# Altium project SPARTAN6.PrjPcb
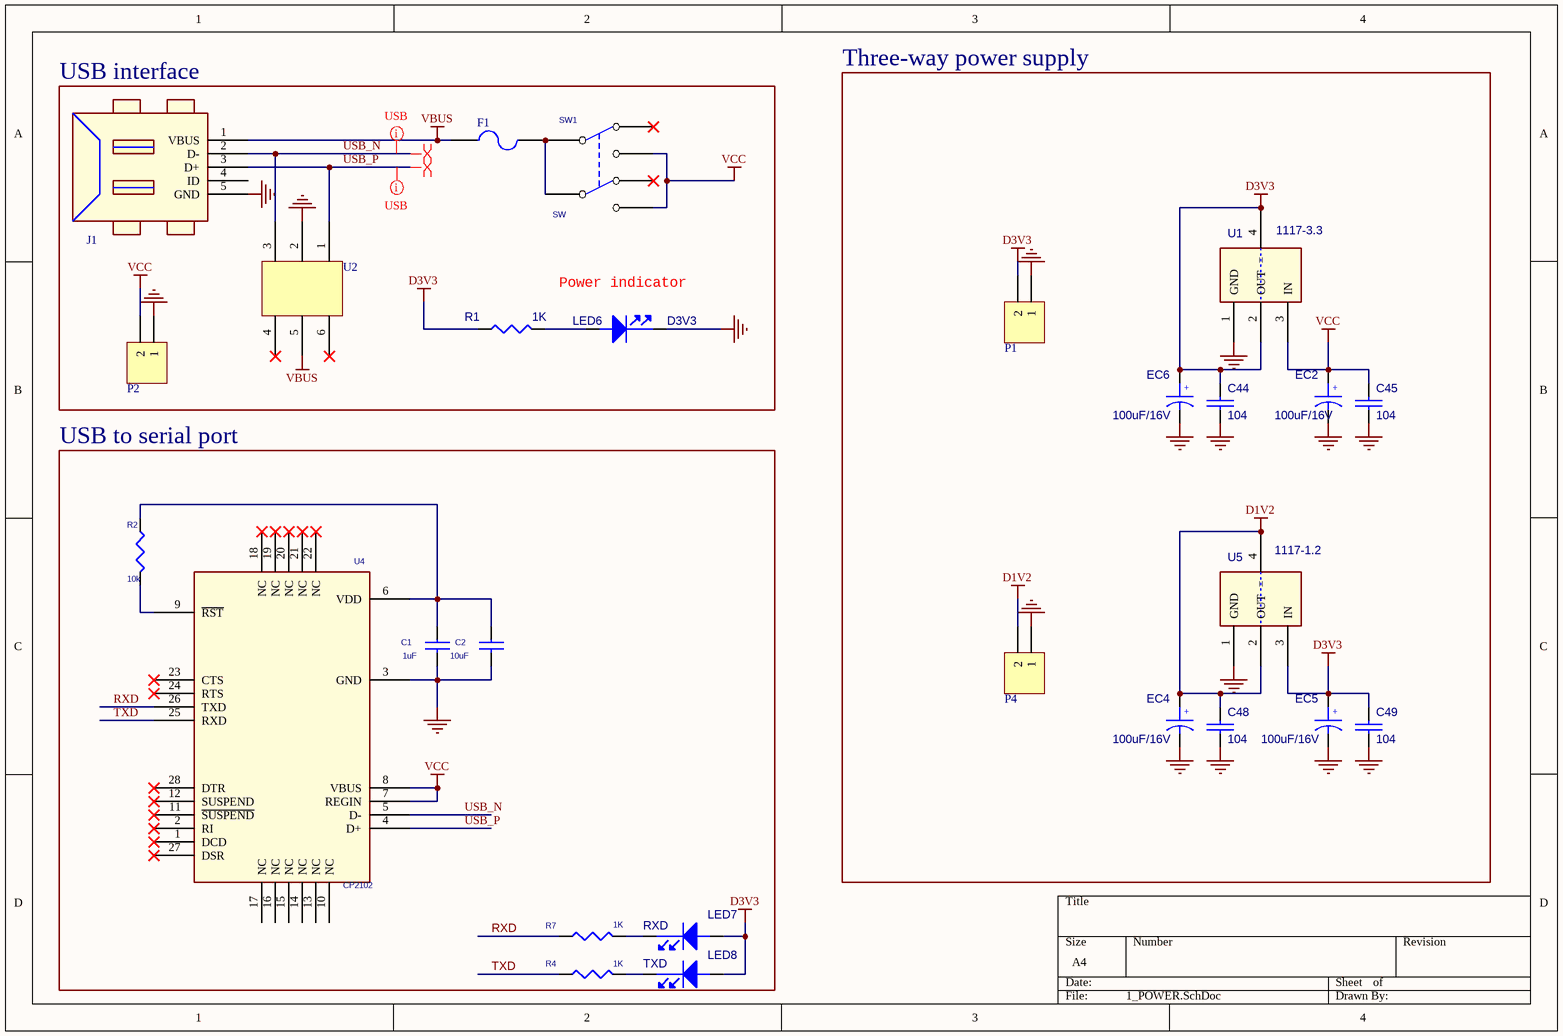
[diagram p0: 1_POWER.SchDoc]
7 sheets, 184 parts. Net scope: global (net labels, ports and power ports of the same name join across sheets).
Board file: PCB3.PcbDoc
Sheets:
  1_POWER.SchDoc
  2_FPGA.SchDoc
  3_FPGA.SchDoc
  4_FPGA.SchDoc
  5_SDRAM.SchDoc
  6_DIG.SchDoc
  7_VGA.SchDoc

## Sheet 1_POWER.SchDoc: AX309   Http://www.heijin.org
size A4; DocumentNumber: 1; Revision: 1.0; SheetNumber: 1; SheetTotal: 7; PageSetup: Record=PageOptions|CenterHorizontal=True|CenterVertical=True|PrintScale=1.00|XCorrection=1.00|YCorrection=1.00|PrintKind=0|BorderSize=5000000|LeftOffset=0|BottomOffset=0|Orientation=2|PaperLength=1000|PaperWidth=1000|Scale=100|PaperSource=7|PrintQuality=-4|MediaType=1|DitherType=10|PrintScaleMode=1|PaperKind=A4|PaperIndex=9

### Parts
C1  1uF  [0603]
C2  10uF  [0805]
C44  104  [0402]
C45  104  [0402]
C48  104  [0402]
C49  104  [0402]
EC2  100uF/16V  [AEC6.5]
EC4  100uF/16V  [AEC6.5]
EC5  100uF/16V  [AEC6.5]
EC6  100uF/16V  [AEC6.5]
F1  (no value)  [1206]
J1  EC2  [MINIUSBB]  (value not drawn)
LED6  D3V3  [LEDSO]
LED7  RXD  [LEDSO]
LED8  TXD  [LEDSO]
P1  3.3V  [HDR1X2]  (value not drawn)
P2  5V  [HDR1X2]  (value not drawn)
P4  1.2V  [HDR1X2]  (value not drawn)
R1  1K  [0603]
R2  10k  [0603]
R4  1K  [0603]
R7  1K  [0603]
SW1  SW  [KEY_DPDT]
U1  1117-3.3  [SOT223]
U2  (no value)  [SOT23-6]
U4  CP2102  [QFN28]
U5  1117-1.2  [SOT223]

### Blocks framed on the sheet
USB interface: F1 J1 LED6 P2 R1 SW1 U2
Three-way power supply: C44 C45 C48 C49 EC2 EC4-EC6 P1 P4 U1 U5
USB to serial port: C1 C2 LED7 LED8 R2 R4 R7 U4

### Nets
D1V2: C48.1 EC4.1 P4.2 U5.2(OUT) U5.4(=)
D3V3: C44.1 C49.1 EC5.1 EC6.1 LED7.1(ANODE) LED8.1(ANODE) P1.2 R1.1 U1.2(OUT) U1.4(=) U5.3(IN)
GND: C1.2 C2.2 C44.2 C45.2 C48.2 C49.2 EC2.2 EC4.2 EC5.2 EC6.2 J1.5(GND) LED6.2(CATHODE) P1.1 P2.1 P4.1 U1.1(GND) U2.2 U4.3(GND) U5.1(GND)
VBUS: F1.1 J1.1(VBUS) U2.5
VCC: C45.1 EC2.1 P2.2 SW1.3(NO1) SW1.6(NO2) U1.3(IN) U4.7(REGIN) U4.8(VBUS)
RXD: R7.1 U4.26(TXD)
TXD: R4.1 U4.25(RXD)
USB_N: J1.2(D-) U2.3 U4.5(D-)
USB_P: J1.3(D+) U2.1 U4.4(D+)
NetC1_1: C1.1 C2.1 R2.2 U4.6(VDD)
NetF1_2: F1.2 SW1.2(COMMON1) SW1.5(COMMON2)
NetLED6_1: LED6.1(ANODE) R1.2
NetLED7_2: LED7.2(CATHODE) R7.2
NetLED8_2: LED8.2(CATHODE) R4.2
NetR2_1: R2.1 U4.9(~{RST})

Not connected (* = marked no-connect by the designer): J1 4(ID); SW1 1(NC1)* 4(NC2)*; U2 4* 6*; U4 1(DCD)* 2(RI)* 10(NC) 11(~{SUSPEND})* 12(SUSPEND)* 13(NC) 14(NC) 15(NC) 16(NC) 17(NC) 18(NC)* 19(NC)* 20(NC)* 21(NC)* 22(NC)* 23(CTS)* 24(RTS)* 27(DSR)* 28(DTR)*

### Layout directives
differential pair: USB_N, USB_P
net class USB; rule Differential Pairs Routing [Pref Gap = 5mil    Min Gap  = 5mil    Max Gap  = 5milPref Width = 6.41mil    Min Width  = 6.41mil    Max Width  = 6.41mil]; rule Matched Net Lengths [Tolerance = 100mil]: USB_N, USB_P

### Notes on the sheet
- Power indicator
- Title
- Size:
- Date:
- A4
- Number:
- Time:
- Revision:
- Sheet
- of
- File:
- (in symbol EC) +

### Library data of the parts
C1 C2 = CAP NP_Dup2
C44 C45 C48 C49 = C_Dup4
EC2 EC4-EC6 = EC
F1 = Fuse 2: Fuse; Published: 8-Jun-2000; LatestRevisionDate: 17-Jul-2002; LatestRevisionNote: Re-released for DXP Platform.; PackageReference: PIN-W2/E2.8; Publisher: Altium Limited; PackageDescription: Thru-Hole; 2 Leads
J1 = MiniUSBB: R50: J5
LED6 = LED_Dup1
LED7 LED8 = LED
P1 P2 P4 = Header 2: Header, 2-Pin; LatestRevisionDate: 17-Jul-2002; LatestRevisionNote: Re-released for DXP Platform.; Publisher: Altium Limited
R1 = R
R2 = RESISTOR
R4 R7 = R_Dup3
SW1 = SW KEY-DPDT
U2 = SRV05-4
U4 = CP2102_0
U5 = 1117-3.3

## Sheet 2_FPGA.SchDoc: AX309 Http://www.heijin.org
size OrCAD A; DocumentNumber: 2; Revision: 1.0; SheetNumber: 2; SheetTotal: 7; PageSetup: Record=PageOptions|CenterHorizontal=True|CenterVertical=True|PrintScale=1.03|XCorrection=1.00|YCorrection=1.00|PrintKind=0|BorderSize=5000000|LeftOffset=0|BottomOffset=0|Orientation=2|PaperLength=1000|PaperWidth=1000|Scale=100|PaperSource=15|PrintQuality=1200|MediaType=1|DitherType=10|PrintScaleMode=1|PaperKind=A4|PaperIndex=9
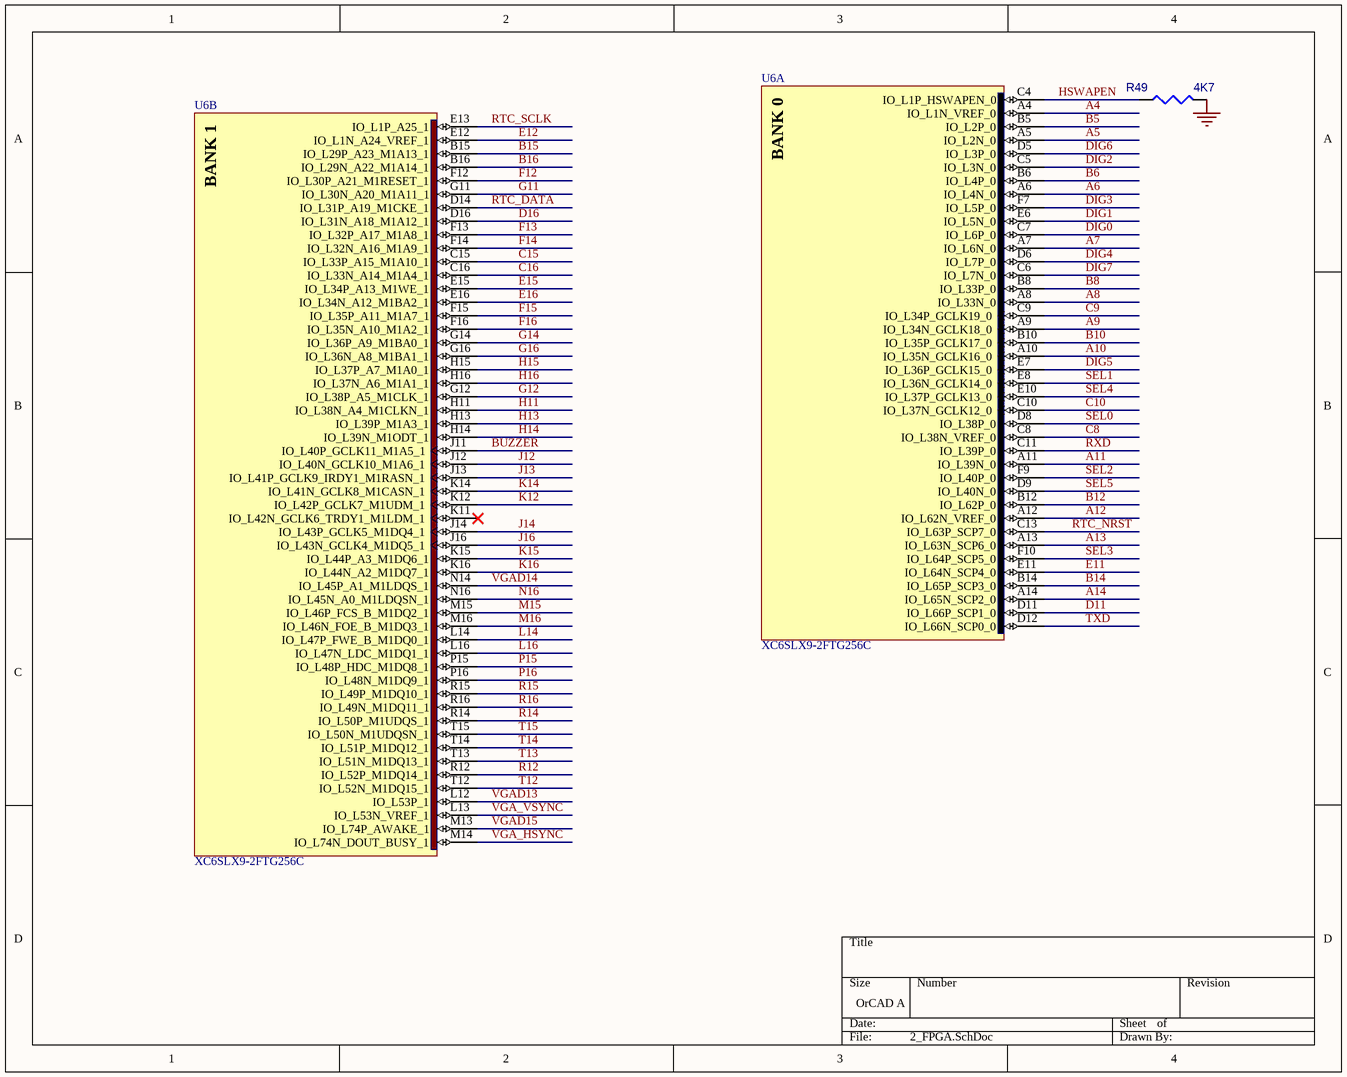
[diagram p1: 2_FPGA.SchDoc]

### Parts
R49  4K7  [0603]
U6  XC6SLX9-2FTG256C  [FTG256]  (parts A,B of 7)

### Nets
GND: R49.2
A4: U6.A4(IO_L1N_VREF_0)
A5: U6.A5(IO_L2N_0)
A6: U6.A6(IO_L4N_0)
A7: U6.A7(IO_L6N_0)
A8: U6.A8(IO_L33N_0)
A9: U6.A9(IO_L34N_GCLK18_0)
A10: U6.A10(IO_L35N_GCLK16_0)
A11: U6.A11(IO_L39N_0)
A12: U6.A12(IO_L62N_VREF_0)
A13: U6.A13(IO_L63N_SCP6_0)
A14: U6.A14(IO_L65N_SCP2_0)
B5: U6.B5(IO_L2P_0)
B6: U6.B6(IO_L4P_0)
B8: U6.B8(IO_L33P_0)
B10: U6.B10(IO_L35P_GCLK17_0)
B12: U6.B12(IO_L62P_0)
B14: U6.B14(IO_L65P_SCP3_0)
B15: U6.B15(IO_L29P_A23_M1A13_1)
B16: U6.B16(IO_L29N_A22_M1A14_1)
BUZZER: U6.J11(IO_L40P_GCLK11_M1A5_1)
C8: U6.C8(IO_L38N_VREF_0)
C9: U6.C9(IO_L34P_GCLK19_0)
C10: U6.C10(IO_L37N_GCLK12_0)
C15: U6.C15(IO_L33P_A15_M1A10_1)
C16: U6.C16(IO_L33N_A14_M1A4_1)
D11: U6.D11(IO_L66P_SCP1_0)
D16: U6.D16(IO_L31N_A18_M1A12_1)
DIG0: U6.C7(IO_L6P_0)
DIG1: U6.E6(IO_L5N_0)
DIG2: U6.C5(IO_L3N_0)
DIG3: U6.F7(IO_L5P_0)
DIG4: U6.D6(IO_L7P_0)
DIG5: U6.E7(IO_L36P_GCLK15_0)
DIG6: U6.D5(IO_L3P_0)
DIG7: U6.C6(IO_L7N_0)
E11: U6.E11(IO_L64N_SCP4_0)
E12: U6.E12(IO_L1N_A24_VREF_1)
E15: U6.E15(IO_L34P_A13_M1WE_1)
E16: U6.E16(IO_L34N_A12_M1BA2_1)
F12: U6.F12(IO_L30P_A21_M1RESET_1)
F13: U6.F13(IO_L32P_A17_M1A8_1)
F14: U6.F14(IO_L32N_A16_M1A9_1)
F15: U6.F15(IO_L35P_A11_M1A7_1)
F16: U6.F16(IO_L35N_A10_M1A2_1)
G11: U6.G11(IO_L30N_A20_M1A11_1)
G12: U6.G12(IO_L38P_A5_M1CLK_1)
G14: U6.G14(IO_L36P_A9_M1BA0_1)
G16: U6.G16(IO_L36N_A8_M1BA1_1)
H11: U6.H11(IO_L38N_A4_M1CLKN_1)
H13: U6.H13(IO_L39P_M1A3_1)
H14: U6.H14(IO_L39N_M1ODT_1)
H15: U6.H15(IO_L37P_A7_M1A0_1)
H16: U6.H16(IO_L37N_A6_M1A1_1)
HSWAPEN: R49.1 U6.C4(IO_L1P_HSWAPEN_0)
J12: U6.J12(IO_L40N_GCLK10_M1A6_1)
J13: U6.J13(IO_L41P_GCLK9_IRDY1_M1RASN_1)
J14: U6.J14(IO_L43P_GCLK5_M1DQ4_1)
J16: U6.J16(IO_L43N_GCLK4_M1DQ5_1)
K12: U6.K12(IO_L42P_GCLK7_M1UDM_1)
K14: U6.K14(IO_L41N_GCLK8_M1CASN_1)
K15: U6.K15(IO_L44P_A3_M1DQ6_1)
K16: U6.K16(IO_L44N_A2_M1DQ7_1)
L14: U6.L14(IO_L47P_FWE_B_M1DQ0_1)
L16: U6.L16(IO_L47N_LDC_M1DQ1_1)
M15: U6.M15(IO_L46P_FCS_B_M1DQ2_1)
M16: U6.M16(IO_L46N_FOE_B_M1DQ3_1)
N16: U6.N16(IO_L45N_A0_M1LDQSN_1)
P15: U6.P15(IO_L48P_HDC_M1DQ8_1)
P16: U6.P16(IO_L48N_M1DQ9_1)
R12: U6.R12(IO_L52P_M1DQ14_1)
R14: U6.R14(IO_L50P_M1UDQS_1)
R15: U6.R15(IO_L49P_M1DQ10_1)
R16: U6.R16(IO_L49N_M1DQ11_1)
RTC_DATA: U6.D14(IO_L31P_A19_M1CKE_1)
RTC_NRST: U6.C13(IO_L63P_SCP7_0)
RTC_SCLK: U6.E13(IO_L1P_A25_1)
RXD: U6.C11(IO_L39P_0)
SEL0: U6.D8(IO_L38P_0)
SEL1: U6.E8(IO_L36N_GCLK14_0)
SEL2: U6.F9(IO_L40P_0)
SEL3: U6.F10(IO_L64P_SCP5_0)
SEL4: U6.E10(IO_L37P_GCLK13_0)
SEL5: U6.D9(IO_L40N_0)
T12: U6.T12(IO_L52N_M1DQ15_1)
T13: U6.T13(IO_L51N_M1DQ13_1)
T14: U6.T14(IO_L51P_M1DQ12_1)
T15: U6.T15(IO_L50N_M1UDQSN_1)
TXD: U6.D12(IO_L66N_SCP0_0)
VGA_HSYNC: U6.M14(IO_L74N_DOUT_BUSY_1)
VGA_VSYNC: U6.L13(IO_L53N_VREF_1)
VGAD13: U6.L12(IO_L53P_1)
VGAD14: U6.N14(IO_L45P_A1_M1LDQS_1)
VGAD15: U6.M13(IO_L74P_AWAKE_1)

Not connected (* = marked no-connect by the designer): U6 K11(IO_L42N_GCLK6_TRDY1_M1LDM_1)*

### Notes on the sheet
- Title
- Size:
- Date:
- Orcad A
- Number:
- Time:
- Revision:
- Sheet
- of
- File:
- (in symbol XC6SLX9-2FTG256C, part A) BANK 0
- (in symbol XC6SLX9-2FTG256C, part B) BANK 1

### Library data of the parts
R49 = R
U6 = XC6SLX9-2FTG256C: Spartan-6 LX 1.2V FPGA, 186 User I/Os, 256-Ball Fine-Pitch Thin BGA (1.0mm Pitch), Speed Grade 2, Commercial Grade, Pb-Free; DatasheetVersion: ver1.6, Nov-2010; PackageVersion: ver1.3, Oct-2007; PackageReference: FTG256; PackageDescription: 256-Ball Fine Pitch Thin Ball Grid Array 1.00 mm Pitch (FTG256) - Pb-Free; Code_JEDEC: MS-034-AAF-1*; ComponentLink1Description: Manufacturer URL; ComponentLink1URL: http://www.xilinx.com/; ComponentLink2Description: Spartan-6 Datasheet; ComponentLink2URL: http://www.xilinx.com/support/documentation/data_sheets/ds160.pdf; ComponentLink3Description: Spartan-6 Documents; ComponentLink3URL: http://www.xilinx.com/support/documentation/spartan-6.htm

## Sheet 3_FPGA.SchDoc: AX309  Http://www.heijin.org
size OrCAD A; DocumentNumber: 3; Revision: 1.0; SheetNumber: 3; SheetTotal: 7; PageSetup: Record=PageOptions|CenterHorizontal=True|CenterVertical=True|PrintScale=1.03|XCorrection=1.00|YCorrection=1.00|PrintKind=0|BorderSize=5000000|LeftOffset=0|BottomOffset=0|Orientation=2|PaperLength=1000|PaperWidth=1000|Scale=100|PaperSource=7|PrintQuality=-4|MediaType=1|DitherType=10|PrintScaleMode=1|PaperKind=A4|PaperIndex=9
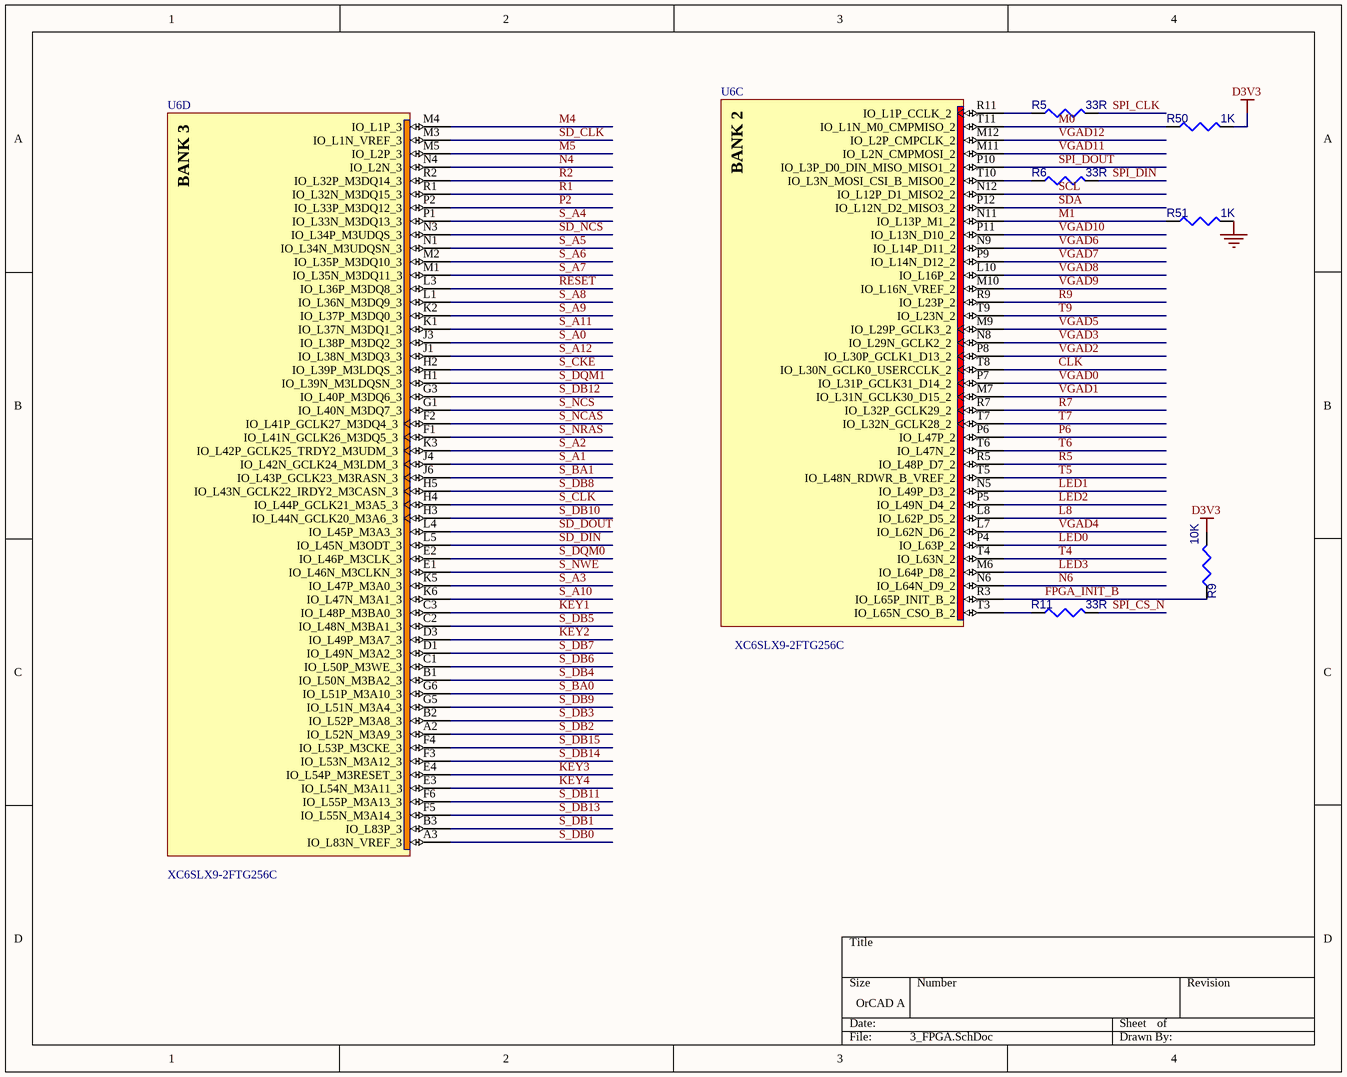
[diagram p2: 3_FPGA.SchDoc]

### Parts
R5  33R  [0603]
R6  33R  [0603]
R9  10K  [0603]
R11  33R  [0603]
R50  1K  [0603]
R51  1K  [0603]
U6  XC6SLX9-2FTG256C  [FTG256]  (parts C,D of 7)

### Nets
D3V3: R9.2 R50.2
GND: R51.2
CLK: U6.T8(IO_L30N_GCLK0_USERCCLK_2)
FPGA_INIT_B: R9.1 U6.R3(IO_L65P_INIT_B_2)
KEY1: U6.C3(IO_L48P_M3BA0_3)
KEY2: U6.D3(IO_L49P_M3A7_3)
KEY3: U6.E4(IO_L54P_M3RESET_3)
KEY4: U6.E3(IO_L54N_M3A11_3)
L8: U6.L8(IO_L62P_D5_2)
LED0: U6.P4(IO_L63P_2)
LED1: U6.N5(IO_L49P_D3_2)
LED2: U6.P5(IO_L49N_D4_2)
LED3: U6.M6(IO_L64P_D8_2)
M0: R50.1 U6.T11(IO_L1N_M0_CMPMISO_2)
M1: R51.1 U6.N11(IO_L13P_M1_2)
M4: U6.M4(IO_L1P_3)
M5: U6.M5(IO_L2P_3)
N4: U6.N4(IO_L2N_3)
N6: U6.N6(IO_L64N_D9_2)
P2: U6.P2(IO_L33P_M3DQ12_3)
P6: U6.P6(IO_L47P_2)
R1: U6.R1(IO_L32N_M3DQ15_3)
R2: U6.R2(IO_L32P_M3DQ14_3)
R5: U6.R5(IO_L48P_D7_2)
R7: U6.R7(IO_L32P_GCLK29_2)
R9: U6.R9(IO_L23P_2)
RESET: U6.L3(IO_L36P_M3DQ8_3)
S_A0: U6.J3(IO_L38P_M3DQ2_3)
S_A1: U6.J4(IO_L42N_GCLK24_M3LDM_3)
S_A2: U6.K3(IO_L42P_GCLK25_TRDY2_M3UDM_3)
S_A3: U6.K5(IO_L47P_M3A0_3)
S_A4: U6.P1(IO_L33N_M3DQ13_3)
S_A5: U6.N1(IO_L34N_M3UDQSN_3)
S_A6: U6.M2(IO_L35P_M3DQ10_3)
S_A7: U6.M1(IO_L35N_M3DQ11_3)
S_A8: U6.L1(IO_L36N_M3DQ9_3)
S_A9: U6.K2(IO_L37P_M3DQ0_3)
S_A10: U6.K6(IO_L47N_M3A1_3)
S_A11: U6.K1(IO_L37N_M3DQ1_3)
S_A12: U6.J1(IO_L38N_M3DQ3_3)
S_BA0: U6.G6(IO_L51P_M3A10_3)
S_BA1: U6.J6(IO_L43P_GCLK23_M3RASN_3)
S_CKE: U6.H2(IO_L39P_M3LDQS_3)
S_CLK: U6.H4(IO_L44P_GCLK21_M3A5_3)
S_DB0: U6.A3(IO_L83N_VREF_3)
S_DB1: U6.B3(IO_L83P_3)
S_DB2: U6.A2(IO_L52N_M3A9_3)
S_DB3: U6.B2(IO_L52P_M3A8_3)
S_DB4: U6.B1(IO_L50N_M3BA2_3)
S_DB5: U6.C2(IO_L48N_M3BA1_3)
S_DB6: U6.C1(IO_L50P_M3WE_3)
S_DB7: U6.D1(IO_L49N_M3A2_3)
S_DB8: U6.H5(IO_L43N_GCLK22_IRDY2_M3CASN_3)
S_DB9: U6.G5(IO_L51N_M3A4_3)
S_DB10: U6.H3(IO_L44N_GCLK20_M3A6_3)
S_DB11: U6.F6(IO_L55P_M3A13_3)
S_DB12: U6.G3(IO_L40P_M3DQ6_3)
S_DB13: U6.F5(IO_L55N_M3A14_3)
S_DB14: U6.F3(IO_L53N_M3A12_3)
S_DB15: U6.F4(IO_L53P_M3CKE_3)
S_DQM0: U6.E2(IO_L46P_M3CLK_3)
S_DQM1: U6.H1(IO_L39N_M3LDQSN_3)
S_NCAS: U6.F2(IO_L41P_GCLK27_M3DQ4_3)
S_NCS: U6.G1(IO_L40N_M3DQ7_3)
S_NRAS: U6.F1(IO_L41N_GCLK26_M3DQ5_3)
S_NWE: U6.E1(IO_L46N_M3CLKN_3)
SCL: U6.N12(IO_L12P_D1_MISO2_2)
SD_CLK: U6.M3(IO_L1N_VREF_3)
SD_DIN: U6.L5(IO_L45N_M3ODT_3)
SD_DOUT: U6.L4(IO_L45P_M3A3_3)
SD_NCS: U6.N3(IO_L34P_M3UDQS_3)
SDA: U6.P12(IO_L12N_D2_MISO3_2)
SPI_CLK: R5.2
SPI_CS_N: R11.2
SPI_DIN: R6.2
SPI_DOUT: U6.P10(IO_L3P_D0_DIN_MISO_MISO1_2)
T4: U6.T4(IO_L63N_2)
T5: U6.T5(IO_L48N_RDWR_B_VREF_2)
T6: U6.T6(IO_L47N_2)
T7: U6.T7(IO_L32N_GCLK28_2)
T9: U6.T9(IO_L23N_2)
VGAD0: U6.P7(IO_L31P_GCLK31_D14_2)
VGAD1: U6.M7(IO_L31N_GCLK30_D15_2)
VGAD2: U6.P8(IO_L30P_GCLK1_D13_2)
VGAD3: U6.N8(IO_L29N_GCLK2_2)
VGAD4: U6.L7(IO_L62N_D6_2)
VGAD5: U6.M9(IO_L29P_GCLK3_2)
VGAD6: U6.N9(IO_L14P_D11_2)
VGAD7: U6.P9(IO_L14N_D12_2)
VGAD8: U6.L10(IO_L16P_2)
VGAD9: U6.M10(IO_L16N_VREF_2)
VGAD10: U6.P11(IO_L13N_D10_2)
VGAD11: U6.M11(IO_L2N_CMPMOSI_2)
VGAD12: U6.M12(IO_L2P_CMPCLK_2)
NetR5_1: R5.1 U6.R11(IO_L1P_CCLK_2)
NetR6_1: R6.1 U6.T10(IO_L3N_MOSI_CSI_B_MISO0_2)
NetR11_1: R11.1 U6.T3(IO_L65N_CSO_B_2)

### Notes on the sheet
- Title
- Size:
- Date:
- Orcad A
- Number:
- Time:
- Revision:
- Sheet
- of
- File:
- (in symbol XC6SLX9-2FTG256C, part C) BANK 2
- (in symbol XC6SLX9-2FTG256C, part D) BANK 3

### Library data of the parts
R5 R6 R11 = R_Dup3
R9 = R_Dup1
R50 R51 = R
U6 = XC6SLX9-2FTG256C: as U6 on sheet 2_FPGA; DatasheetVersion: ver1.6, Nov-2010; PackageVersion: ver1.3, Oct-2007; PackageReference: FTG256; PackageDescription: 256-Ball Fine Pitch Thin Ball Grid Array 1.00 mm Pitch (FTG256) - Pb-Free; Code_JEDEC: MS-034-AAF-1*; ComponentLink1Description: Manufacturer URL; ComponentLink1URL: http://www.xilinx.com/; ComponentLink2Description: Spartan-6 Datasheet; ComponentLink2URL: http://www.xilinx.com/support/documentation/data_sheets/ds160.pdf; ComponentLink3Description: Spartan-6 Documents; ComponentLink3URL: http://www.xilinx.com/support/documentation/spartan-6.htm

## Sheet 4_FPGA.SchDoc: AX309  Http://www.heijin.org
size A4; DocumentNumber: 4; SheetNumber: 4; SheetTotal: 7; PageSetup: Record=PageOptions|CenterHorizontal=True|CenterVertical=True|PrintScale=1.00|XCorrection=1.00|YCorrection=1.00|PrintKind=0|BorderSize=5000000|LeftOffset=0|BottomOffset=0|Orientation=2|PaperLength=1000|PaperWidth=1000|Scale=100|PaperSource=7|PrintQuality=-4|MediaType=1|DitherType=10|PrintScaleMode=1|PaperKind=A4|PaperIndex=9
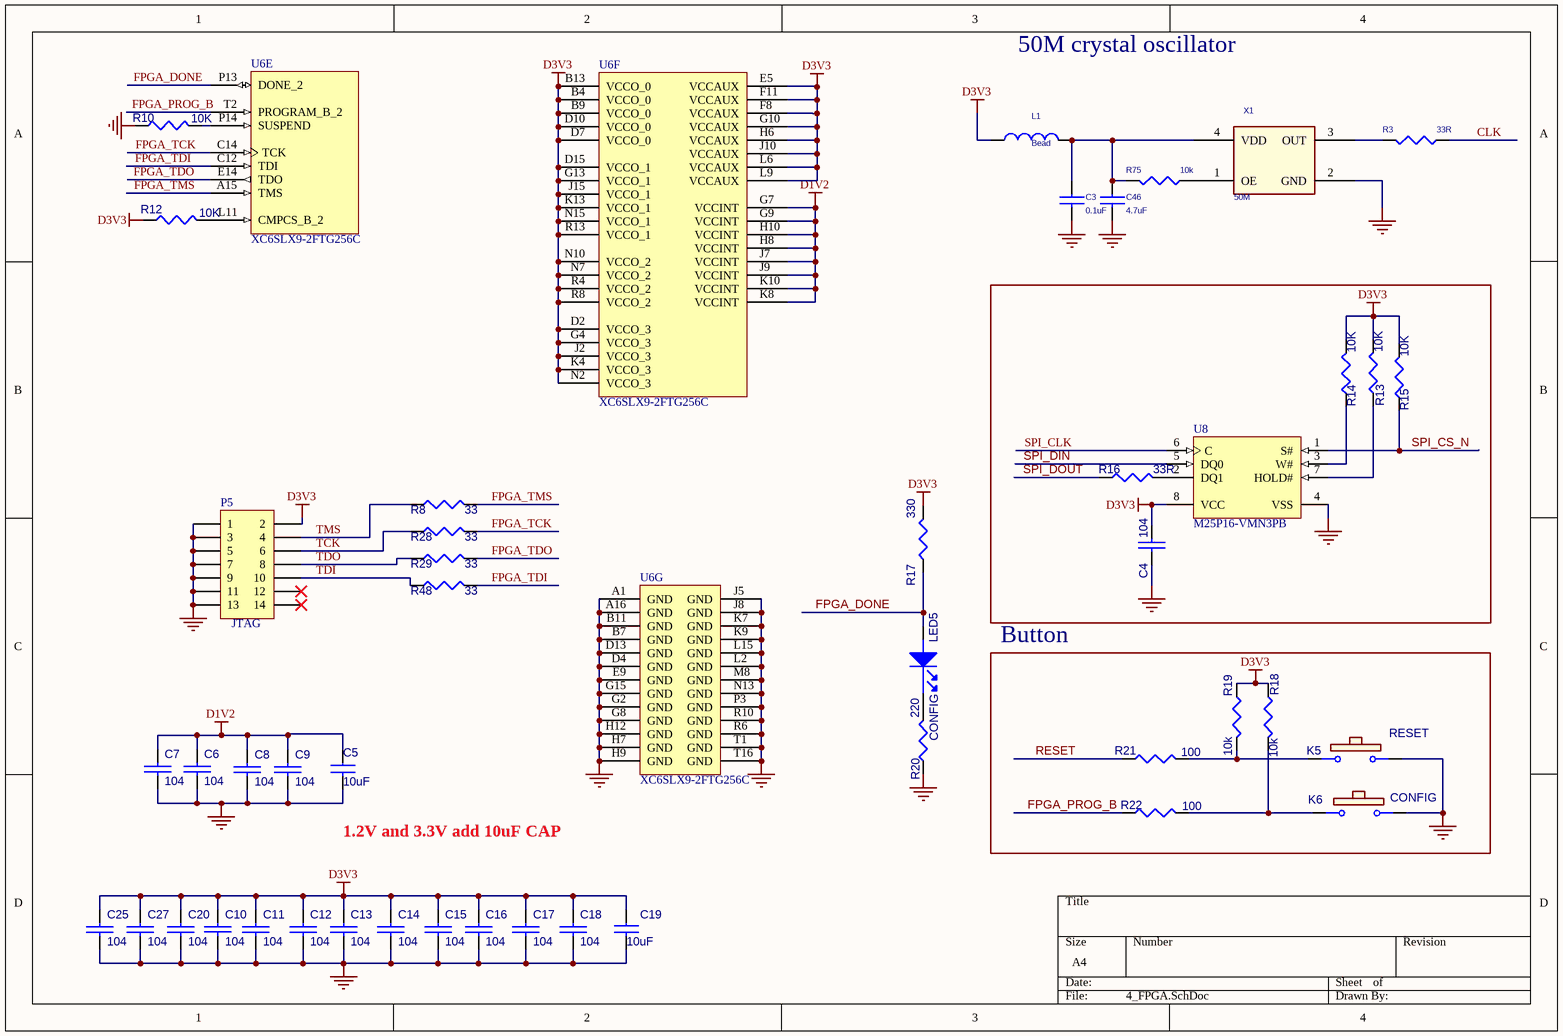
[diagram p3: 4_FPGA.SchDoc]

### Parts
C3  0.1uF  [0402]
C4  104  [0402]
C5  10uF  [0805]
C6  104  [0402]
C7  104  [0402]
C8  104  [0402]
C9  104  [0402]
C10  104  [0402]
C11  104  [0402]
C12  104  [0402]
C13  104  [0402]
C14  104  [0402]
C15  104  [0402]
C16  104  [0402]
C17  104  [0402]
C18  104  [0402]
C19  10uF  [0805]
C20  104  [0402]
C25  104  [0402]
C27  104  [0402]
C46  4.7uF  [0603]
K5  RESET  [KEY735SO]
K6  CONFIG  [KEY735SO]
L1  Bead  [0603]
LED5  CONFIG  [LEDSO]
P5  JTAG  [JTAG14-.5]
R3  33R  [0603]
R8  33  [0603]
R10  10K  [0603]
R12  10K  [0603]
R13  10K  [0603]
R14  10K  [0603]
R15  10K  [0603]
R16  33R  [0603]
R17  330  [0603]
R18  10k  [0603]
R19  10k  [0603]
R20  220  [0603]
R21  100  [0603]
R22  100  [0603]
R28  33  [0603]
R29  33  [0603]
R48  33  [0603]
R75  10k  [0603]
U6  XC6SLX9-2FTG256C  [FTG256]  (parts E,F,G of 7)
U8  M25P16-VMN3PB  [SO8]
X1  50M  [CY_4]

### Blocks framed on the sheet
Button: K5 K6 R18 R19 R21 R22

### Nets
D1V2: C5.1 C6.1 C7.1 C8.1 C9.1 U6.G7(VCCINT) U6.G9(VCCINT) U6.H8(VCCINT) U6.H10(VCCINT) U6.J7(VCCINT) U6.J9(VCCINT) U6.K8(VCCINT) U6.K10(VCCINT)
D3V3: C4.2 C10.1 C11.1 C12.1 C13.1 C14.1 C15.1 C16.1 C17.1 C18.1 C19.1 C20.1 C25.1 C27.1 L1.1 P5.2 R12.1 R13.2 R14.2 R15.2 R17.2 R18.1 R19.1 U6.B4(VCCO_0) U6.B9(VCCO_0) U6.B13(VCCO_0) U6.D2(VCCO_3) U6.D7(VCCO_0) U6.D10(VCCO_0) U6.D15(VCCO_1) U6.E5(VCCAUX) U6.F8(VCCAUX) U6.F11(VCCAUX) U6.G4(VCCO_3) U6.G10(VCCAUX) U6.G13(VCCO_1) U6.H6(VCCAUX) U6.J2(VCCO_3) U6.J10(VCCAUX) U6.J15(VCCO_1) U6.K4(VCCO_3) U6.K13(VCCO_1) U6.L6(VCCAUX) U6.L9(VCCAUX) U6.N2(VCCO_3) U6.N7(VCCO_2) U6.N10(VCCO_2) U6.N15(VCCO_1) U6.R4(VCCO_2) U6.R8(VCCO_2) U6.R13(VCCO_1) U8.8(VCC)
GND: C3.2 C4.1 C5.2 C6.2 C7.2 C8.2 C9.2 C10.2 C11.2 C12.2 C13.2 C14.2 C15.2 C16.2 C17.2 C18.2 C19.2 C20.2 C25.2 C27.2 C46.2 K5.2 K6.1 P5.1 P5.3 P5.5 P5.7 P5.9 P5.11 P5.13 R10.1 R20.1 U6.A1(GND) U6.A16(GND) U6.B7(GND) U6.B11(GND) U6.D4(GND) U6.D13(GND) U6.E9(GND) U6.G2(GND) U6.G8(GND) U6.G15(GND) U6.H7(GND) U6.H9(GND) U6.H12(GND) U6.J5(GND) U6.J8(GND) U6.K7(GND) U6.K9(GND) U6.L2(GND) U6.L15(GND) U6.M8(GND) U6.N13(GND) U6.P3(GND) U6.R6(GND) U6.R10(GND) U6.T1(GND) U6.T16(GND) U8.4(VSS) X1.2(GND)
CLK: R3.1
FPGA_DONE: LED5.1(ANODE) R17.1 U6.P13(DONE_2)
FPGA_PROG_B: R22.1 U6.T2(PROGRAM_B_2)
FPGA_TCK: R28.2 U6.C14(TCK)
FPGA_TDI: R48.2 U6.C12(TDI)
FPGA_TDO: R29.2 U6.E14(TDO)
FPGA_TMS: R8.2 U6.A15(TMS)
RESET: R21.1
SPI_CLK: U8.6(C)
SPI_CS_N: R15.1 U8.1(S#)
SPI_DIN: U8.5(DQ0)
SPI_DOUT: R16.1
TCK: P5.6 R28.1
TDI: P5.10 R48.1
TDO: P5.8 R29.1
TMS: P5.4 R8.1
NetC3_1: C3.1 C46.1 L1.2 R75.2 X1.4(VDD)
NetK5_1: K5.1 R19.2 R21.2
NetK6_2: K6.2 R18.2 R22.2
NetLED5_2: LED5.2(CATHODE) R20.2
NetR3_2: R3.2 X1.3(OUT)
NetR10_2: R10.2 U6.P14(SUSPEND)
NetR12_2: R12.2 U6.L11(CMPCS_B_2)
NetR13_1: R13.1 U8.7(HOLD#)
NetR14_1: R14.1 U8.3(W#)
NetR16_2: R16.2 U8.2(DQ1)
NetR75_1: R75.1 X1.1(OE)

Not connected (* = marked no-connect by the designer): P5 12* 14*

### Notes on the sheet
- 50M crystal oscillator
- 1.2V and 3.3V add 10uF CAP
- Title
- Size:
- Date:
- A4
- Number:
- Time:
- Revision:
- Sheet
- of
- File:

### Library data of the parts
C3 C5 C19 C46 = CAP NP_Dup2
C4 C6-C18 C20 C25 C27 = C_Dup4
K5 K6 = KEYB
L1 = INDUCTOR
LED5 = LED_Dup1
P5 = Header 7X2: Header, 7-Pin, Dual row; LatestRevisionDate: 17-Jul-2002; LatestRevisionNote: Re-released for DXP Platform.; Publisher: Altium Limited
R3 R75 = RESISTOR
R8 R10 R12-R15 R28 R29 R48 = R
R16 = R_Dup3
R17 R20 = R_Dup1
R18 R19 R21 R22 = R_Dup2
U6 = XC6SLX9-2FTG256C: as U6 on sheet 2_FPGA; DatasheetVersion: ver1.6, Nov-2010; PackageVersion: ver1.3, Oct-2007; PackageReference: FTG256; PackageDescription: 256-Ball Fine Pitch Thin Ball Grid Array 1.00 mm Pitch (FTG256) - Pb-Free; Code_JEDEC: MS-034-AAF-1*; ComponentLink1Description: Manufacturer URL; ComponentLink1URL: http://www.xilinx.com/; ComponentLink2Description: Spartan-6 Datasheet; ComponentLink2URL: http://www.xilinx.com/support/documentation/data_sheets/ds160.pdf; ComponentLink3Description: Spartan-6 Documents; ComponentLink3URL: http://www.xilinx.com/support/documentation/spartan-6.htm
U8 = M25P16-VMN3PB: 16 Mb (x1) Automotive Serial NOR Flash Memory, 75 MHz, 2.7 to 3.6 V, 8-pin SO8 Narrow (MN), Tube; Part Family: M25P爘ISHIDDEN=T; Manufacturer: Micron; Density: 16Mb爘ISHIDDEN=T; Speed: 75 MHz爘ISHIDDEN=T; Voltage: 2.7V-3.6V爘ISHIDDEN=T; DatasheetVersion: Rev. Y; PackageVersion: Rev 11; PackageReference: MICT-MN-8; PackageDescription: 8-Pin SO Narrow, 3.9 X 4.9 mm, Pitch 1.27 mm; Applications: Automotive爘ISHIDDEN=T; Package: SO8 Narrow爘ISHIDDEN=T; Part Status: Production爘ISHIDDEN=T; RoHS: Yes爘ISHIDDEN=T; Type: Data Storage爘ISHIDDEN=T; Width: x1爘ISHIDDEN=T; Mounting Technology: Surface Mount; PartNumber: M25P16-VMN3PB; ComponentLink1Description: Manufacturer URL; ComponentLink1URL: http://www.micron.com/; ComponentLink2Description: Datasheet; ComponentLink2URL: http://www.micron.com/~/media/Documents/Products/Data%20Sheet/NOR%20Flash/Serial%20NOR/M25P/M25P16.pdf; ComponentLink3Description: Package Specification; ComponentLink3URL: http://www.micron.com/~/media/Documents/Products/Data%20Sheet/NOR%20Flash/Serial%20NOR/M25P/M25P05A.pdf
X1 = OSC

## Sheet 5_SDRAM.SchDoc: LX9-EVAL Board
size OrCAD A; DocumentNumber: 5; SheetNumber: 5; SheetTotal: 7; PageSetup: Record=PageOptions|CenterHorizontal=True|CenterVertical=True|PrintScale=1.03|XCorrection=1.00|YCorrection=1.00|PrintKind=0|BorderSize=5000000|LeftOffset=0|BottomOffset=0|Orientation=2|PaperLength=1000|PaperWidth=1000|Scale=100|PaperSource=7|PrintQuality=-4|MediaType=1|DitherType=10|PrintScaleMode=1|PaperKind=A4|PaperIndex=9
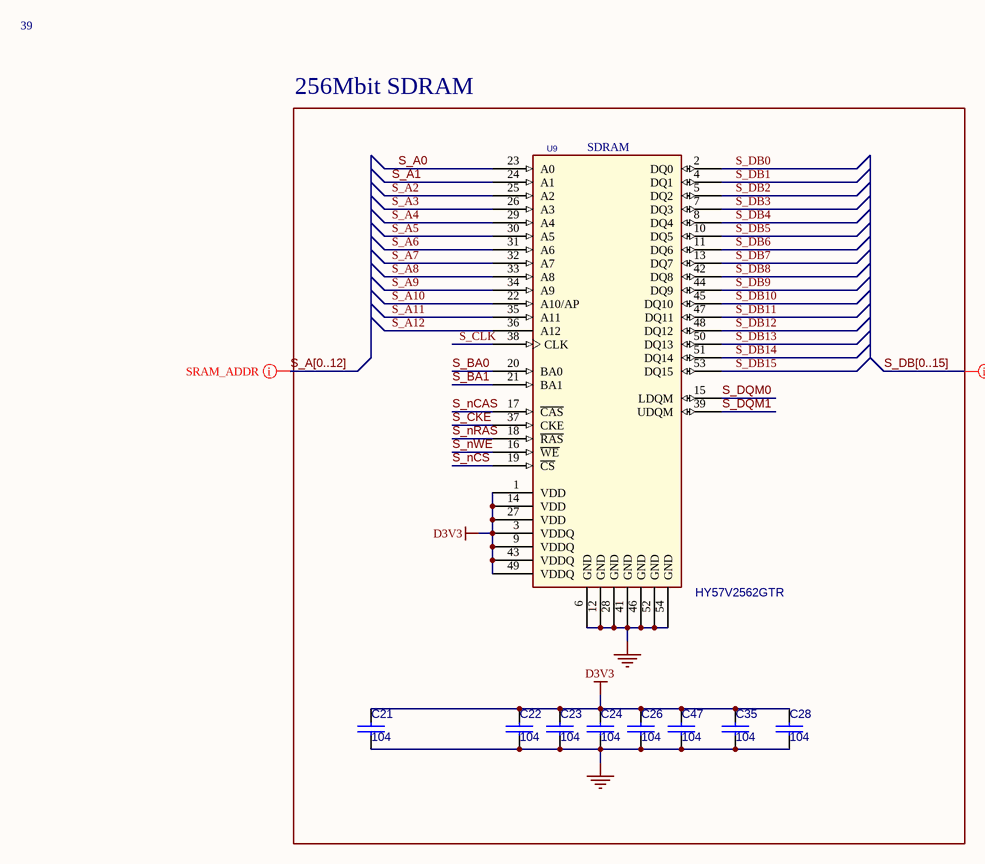
[diagram p4: 5_SDRAM.SchDoc]

### Parts
C21  104  [0402]
C22  104  [0402]
C23  104  [0402]
C24  104  [0402]
C26  104  [0402]
C28  104  [0402]
C35  104  [0402]
C47  104  [0402]
U9  HY57V2562GTR  [TSOP-54]

### Nets
D3V3: C21.1 C22.1 C23.1 C24.1 C26.1 C28.1 C35.1 C47.1 U9.1(VDD) U9.3(VDDQ) U9.9(VDDQ) U9.14(VDD) U9.27(VDD) U9.43(VDDQ) U9.49(VDDQ)
GND: C21.2 C22.2 C23.2 C24.2 C26.2 C28.2 C35.2 C47.2 U9.6(GND) U9.12(GND) U9.28(GND) U9.41(GND) U9.46(GND) U9.52(GND) U9.54(GND)
S_A0: U9.23(A0)
S_A1: U9.24(A1)
S_A2: U9.25(A2)
S_A3: U9.26(A3)
S_A4: U9.29(A4)
S_A5: U9.30(A5)
S_A6: U9.31(A6)
S_A7: U9.32(A7)
S_A8: U9.33(A8)
S_A9: U9.34(A9)
S_A10: U9.22(A10/AP)
S_A11: U9.35(A11)
S_A12: U9.36(A12)
S_BA0: U9.20(BA0)
S_BA1: U9.21(BA1)
S_CKE: U9.37(CKE)
S_CLK: U9.38(CLK)
S_DB0: U9.2(DQ0)
S_DB1: U9.4(DQ1)
S_DB2: U9.5(DQ2)
S_DB3: U9.7(DQ3)
S_DB4: U9.8(DQ4)
S_DB5: U9.10(DQ5)
S_DB6: U9.11(DQ6)
S_DB7: U9.13(DQ7)
S_DB8: U9.42(DQ8)
S_DB9: U9.44(DQ9)
S_DB10: U9.45(DQ10)
S_DB11: U9.47(DQ11)
S_DB12: U9.48(DQ12)
S_DB13: U9.50(DQ13)
S_DB14: U9.51(DQ14)
S_DB15: U9.53(DQ15)
S_DQM0: U9.15(LDQM)
S_DQM1: U9.39(UDQM)
S_NCAS: U9.17(~{CAS})
S_NCS: U9.19(~{CS})
S_NRAS: U9.18(~{RAS})
S_NWE: U9.16(~{WE})

### Buses and harness runs
bus S_A[0..12]
bus S_DB[0..15]

### Layout directives
rule Matched Net Lengths [Tolerance = 100mil]; net class SRAM_DATA: (no net found under the mark)
rule Matched Net Lengths [Tolerance = 100mil]; net class SRAM_ADDR: (no net found under the mark)

### Notes on the sheet
- 39
- 256Mbit SDRAM
- (near U9) SDRAM
- Title
- Size:
- Date:
- Orcad A
- Number:
- Time:
- Revision:
- Sheet
- of
- File:

### Library data of the parts
C21-C24 C26 C28 C35 C47 = C_Dup2
U9 = HY57651620/SO_0

## Sheet 6_DIG.SchDoc: AX309  Http://www.heijin.org
size OrCAD B; DocumentNumber: 6; SheetNumber: 6; SheetTotal: 7; PageSetup: Record=PageOptions|CenterHorizontal=True|CenterVertical=True|PrintScale=0.75|XCorrection=1.00|YCorrection=1.00|PrintKind=0|BorderSize=5000000|LeftOffset=0|BottomOffset=0|Orientation=2|PaperLength=1000|PaperWidth=1000|Scale=100|PaperSource=7|PrintQuality=-4|MediaType=1|DitherType=10|PrintScaleMode=1|PaperKind=A4|PaperIndex=9
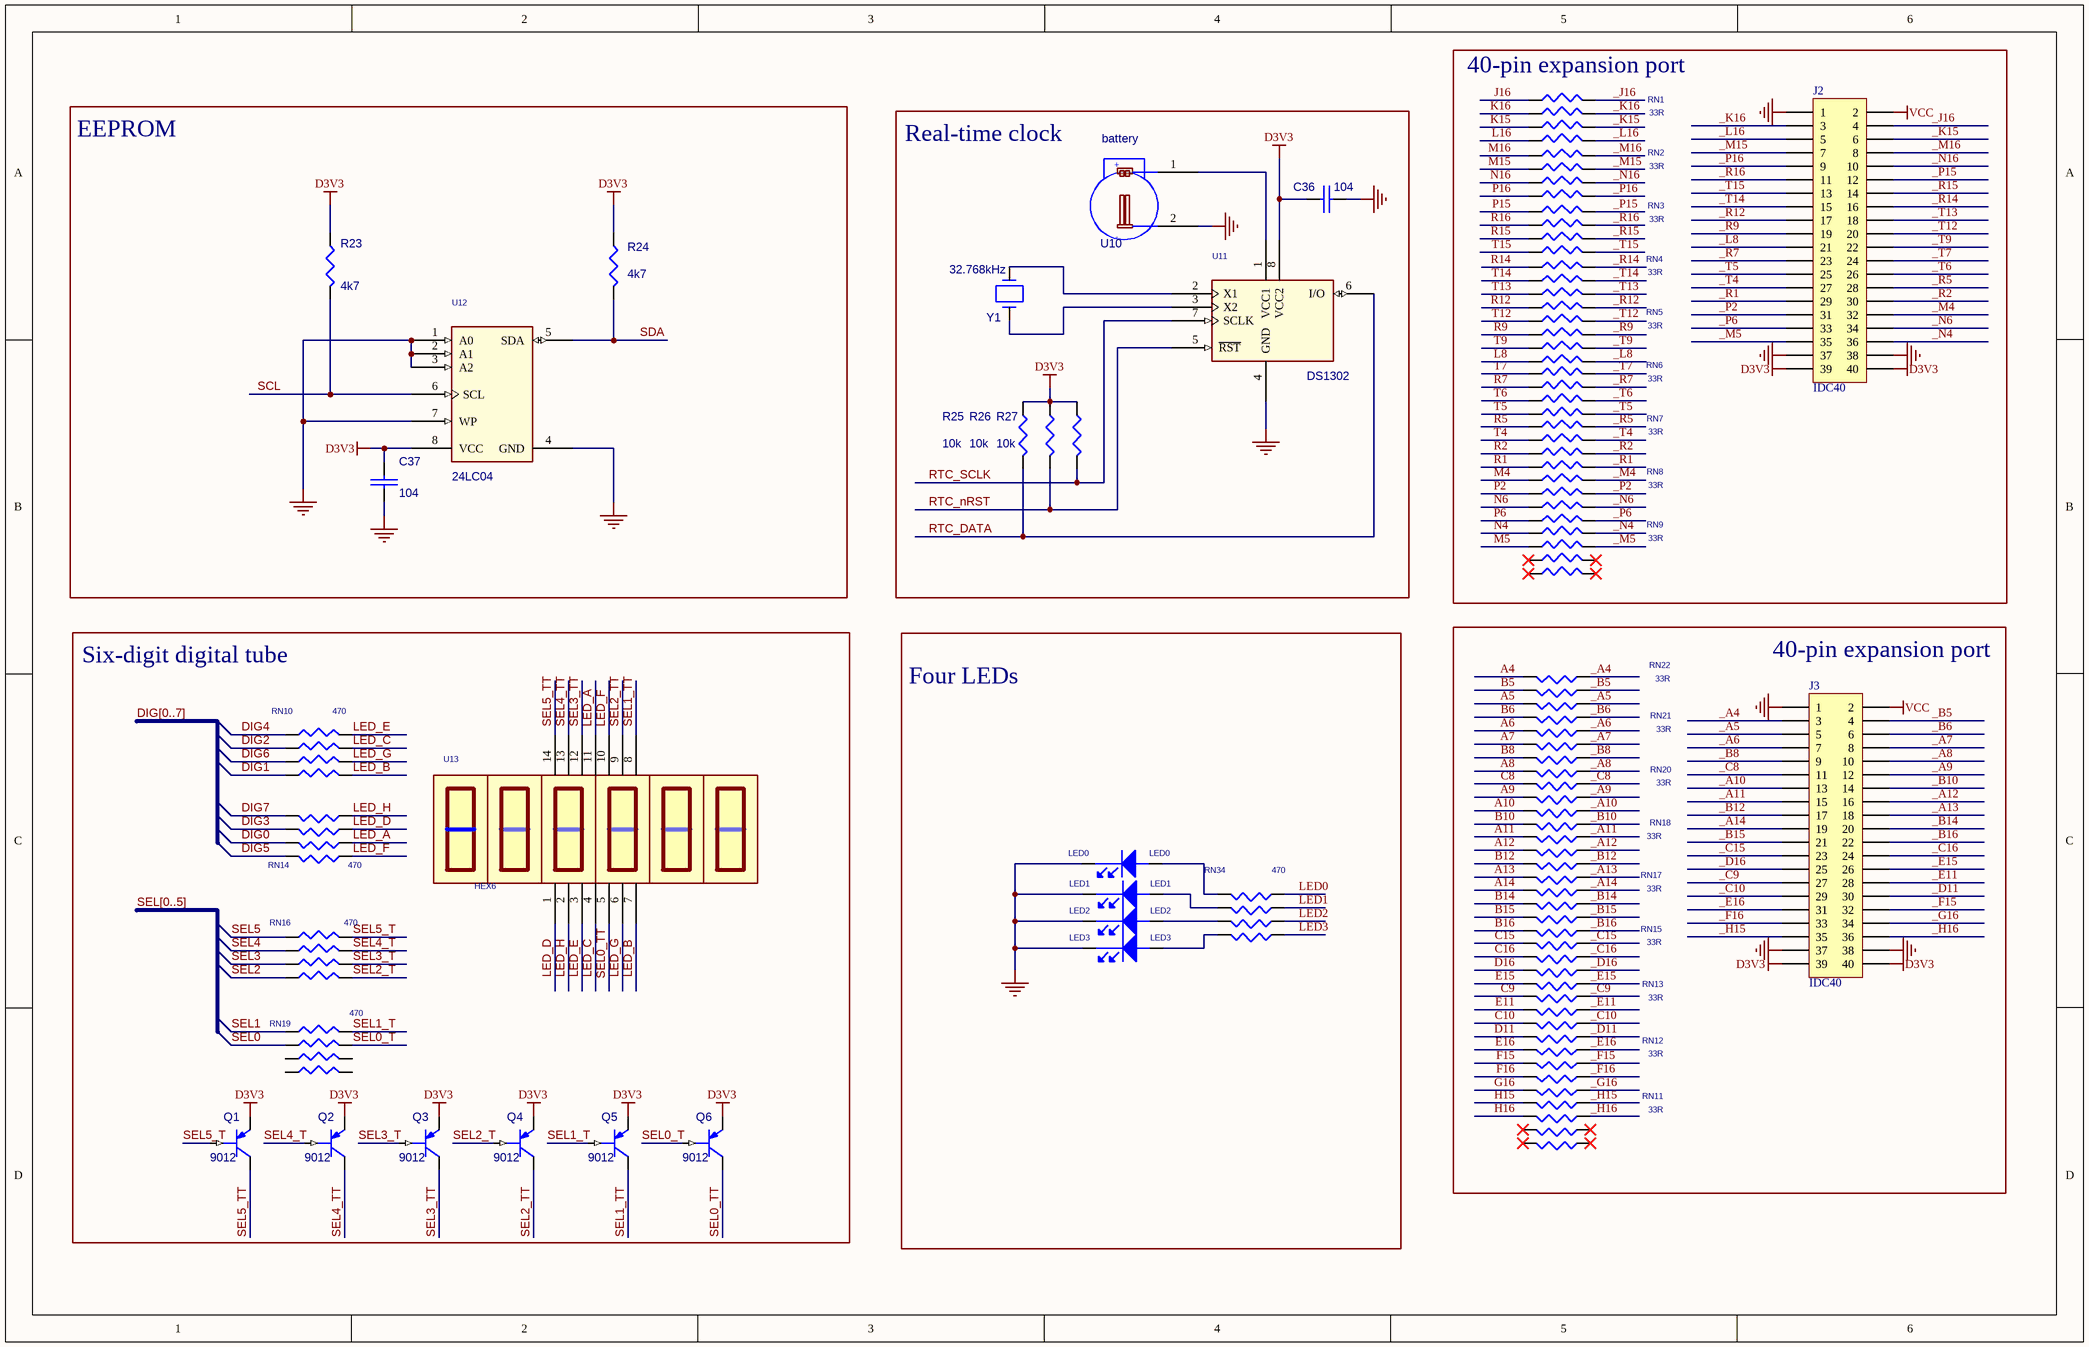
[diagram p5: 6_DIG.SchDoc]

### Parts
C36  104  [0402]
C37  104  [0402]
J2  IDC40  [IDC-40J]
J3  IDC40  [IDC-40J]
LED0  LED0  [LEDSO]
LED1  LED1  [LEDso]
LED2  LED2  [LEDSO]
LED3  LED3  [LEDSO]
Q1  9012  [SOT23]
Q2  9012  [SOT23]
Q3  9012  [SOT23]
Q4  9012  [SOT23]
Q5  9012  [SOT23]
Q6  9012  [SOT23]
R23  4k7  [0603]
R24  4k7  [0603]
R25  10k  [0603]
R26  10k  [0603]
R27  10k  [0603]
RN1  33R  [RN-8P]
RN2  33R  [RN-8P]
RN3  33R  [RN-8P]
RN4  33R  [RN-8P]
RN5  33R  [RN-8P]
RN6  33R  [RN-8P]
RN7  33R  [RN-8P]
RN8  33R  [RN-8P]
RN9  33R  [RN-8P]
RN10  470  [RN-8P]
RN11  33R  [RN-8P]
RN12  33R  [RN-8P]
RN13  33R  [RN-8P]
RN14  470  [RN-8P]
RN15  33R  [RN-8P]
RN16  470  [RN-8P]
RN17  33R  [RN-8P]
RN18  33R  [RN-8P]
RN19  470  [RN-8P]
RN20  33R  [RN-8P]
RN21  33R  [RN-8P]
RN22  33R  [RN-8P]
RN34  470  [RN-8P]
U10  battery  [BATSO]
U11  DS1302  [SO8]
U12  24LC04  [SO8]
U13  HEX6  [NIX_6]
Y1  32.768kHz  [CY_SMALL]

### Blocks framed on the sheet
40-pin expansion port: J2 RN1-RN9
EEPROM: C37 R23 R24 U12
Real-time clock: C36 R25-R27 U10 U11 Y1
Six-digit digital tube: Q1-Q6 RN10 RN14 RN16 RN19 U13
Four LEDs: LED0-LED3 RN34
40-pin expansion port: J3 RN11-RN13 RN15 RN17 RN18 RN20-RN22

### Nets
D3V3: C36.1 C37.1 J2.39 J2.40 J3.39 J3.40 Q1.2(EMITTER) Q2.2(EMITTER) Q3.2(EMITTER) Q4.2(EMITTER) Q5.2(EMITTER) Q6.2(EMITTER) R23.1 R24.1 R25.1 R26.1 R27.1 U11.8(VCC2) U12.8(VCC)
GND: C36.2 C37.2 J2.1 J2.37 J2.38 J3.1 J3.37 J3.38 LED0.2(CATHODE) LED1.2(CATHODE) LED2.2(CATHODE) LED3.2(CATHODE) U10.2(GND) U11.4(GND) U12.1(A0) U12.2(A1) U12.3(A2) U12.4(GND) U12.7(WP)
VCC: J2.2 J3.2
_A4: J3.3 RN22.4
_A5: J3.5 RN22.2
_A6: J3.7 RN21.4
_A7: J3.8 RN21.3
_A8: J3.10 RN21.1
_A9: J3.12 RN20.3
_A10: J3.13 RN20.2
_A11: J3.15 RN18.4
_A12: J3.16 RN18.3
_A13: J3.18 RN18.1
_A14: J3.19 RN17.4
_B5: J3.4 RN22.3
_B6: J3.6 RN22.1
_B8: J3.9 RN21.2
_B10: J3.14 RN20.1
_B12: J3.17 RN18.2
_B14: J3.20 RN17.3
_B15: J3.21 RN17.2
_B16: J3.22 RN17.1
_C8: J3.11 RN20.4
_C9: J3.27 RN13.4
_C10: J3.29 RN13.2
_C15: J3.23 RN15.4
_C16: J3.24 RN15.3
_D11: J3.30 RN13.1
_D16: J3.25 RN15.2
_E11: J3.28 RN13.3
_E15: J3.26 RN15.1
_E16: J3.31 RN12.4
_F15: J3.32 RN12.3
_F16: J3.33 RN12.2
_G16: J3.34 RN12.1
_H15: J3.35 RN11.4
_H16: J3.36 RN11.3
_J16: J2.4 RN1.8
_K15: J2.6 RN1.6
_K16: J2.3 RN1.7
_L8: J2.21 RN5.5
_L16: J2.5 RN1.5
_M4: J2.32 RN8.8
_M5: J2.35 RN9.7
_M15: J2.7 RN2.7
_M16: J2.8 RN2.8
_N4: J2.36 RN9.8
_N6: J2.34 RN8.6
_N16: J2.10 RN2.6
_P2: J2.31 RN8.7
_P6: J2.33 RN8.5
_P15: J2.12 RN3.8
_P16: J2.9 RN2.5
_R1: J2.29 RN7.5
_R2: J2.30 RN7.6
_R5: J2.28 RN7.8
_R7: J2.23 RN6.7
_R9: J2.19 RN5.7
_R12: J2.17 RN4.5
_R14: J2.16 RN4.8
_R15: J2.14 RN3.6
_R16: J2.11 RN3.7
_T4: J2.27 RN7.7
_T5: J2.25 RN6.5
_T6: J2.26 RN6.6
_T7: J2.24 RN6.8
_T9: J2.22 RN5.6
_T12: J2.20 RN5.8
_T13: J2.18 RN4.6
_T14: J2.15 RN4.7
_T15: J2.13 RN3.5
A4: RN22.5
A5: RN22.7
A6: RN21.5
A7: RN21.6
A8: RN21.8
A9: RN20.6
A10: RN20.7
A11: RN18.5
A12: RN18.6
A13: RN18.8
A14: RN17.5
B5: RN22.6
B6: RN22.8
B8: RN21.7
B10: RN20.8
B12: RN18.7
B14: RN17.6
B15: RN17.7
B16: RN17.8
C8: RN20.5
C9: RN13.5
C10: RN13.7
C15: RN15.5
C16: RN15.6
D11: RN13.8
D16: RN15.7
DIG0: RN14.7
DIG1: RN10.5
DIG2: RN10.7
DIG3: RN14.6
DIG4: RN10.8
DIG5: RN14.8
DIG6: RN10.6
DIG7: RN14.5
E11: RN13.6
E15: RN15.8
E16: RN12.5
F15: RN12.6
F16: RN12.7
G16: RN12.8
H15: RN11.5
H16: RN11.6
J16: RN1.1
K15: RN1.3
K16: RN1.2
L8: RN5.4
L16: RN1.4
LED0: RN34.4
LED1: RN34.3
LED2: RN34.2
LED3: RN34.1
LED_A: RN14.2 U13.11
LED_B: RN10.4 U13.7
LED_C: RN10.2 U13.4
LED_D: RN14.3 U13.1
LED_E: RN10.1 U13.3
LED_F: RN14.1 U13.10
LED_G: RN10.3 U13.6
LED_H: RN14.4 U13.2
M4: RN8.1
M5: RN9.2
M15: RN2.2
M16: RN2.1
N4: RN9.1
N6: RN8.3
N16: RN2.3
P2: RN8.2
P6: RN8.4
P15: RN3.1
P16: RN2.4
R1: RN7.4
R2: RN7.3
R5: RN7.1
R7: RN6.2
R9: RN5.2
R12: RN4.4
R14: RN4.1
R15: RN3.3
R16: RN3.2
RTC_DATA: R25.2 U11.6(I/O)
RTC_NRST: R26.2 U11.5(~{RST})
RTC_SCLK: R27.2 U11.7(SCLK)
SCL: R23.2 U12.6(SCL)
SDA: R24.2 U12.5(SDA)
SEL0: RN19.7
SEL0_T: Q6.1(BASE) RN19.2
SEL0_TT: Q6.3(COLLECTOR) U13.5
SEL1: RN19.8
SEL1_T: Q5.1(BASE) RN19.1
SEL1_TT: Q5.3(COLLECTOR) U13.8
SEL2: RN16.5
SEL2_T: Q4.1(BASE) RN16.4
SEL2_TT: Q4.3(COLLECTOR) U13.9
SEL3: RN16.6
SEL3_T: Q3.1(BASE) RN16.3
SEL3_TT: Q3.3(COLLECTOR) U13.12
SEL4: RN16.7
SEL4_T: Q2.1(BASE) RN16.2
SEL4_TT: Q2.3(COLLECTOR) U13.13
SEL5: RN16.8
SEL5_T: Q1.1(BASE) RN16.1
SEL5_TT: Q1.3(COLLECTOR) U13.14
T4: RN7.2
T5: RN6.4
T6: RN6.3
T7: RN6.1
T9: RN5.3
T12: RN5.1
T13: RN4.3
T14: RN4.2
T15: RN3.4
NetLED0_1: LED0.1(ANODE) RN34.5
NetLED1_1: LED1.1(ANODE) RN34.6
NetLED2_1: LED2.1(ANODE) RN34.7
NetLED3_1: LED3.1(ANODE) RN34.8
NetU10_1: U10.1(VBAT) U11.1(VCC1)
NetU11_2: U11.2(X1) Y1.1
NetU11_3: U11.3(X2) Y1.2

Not connected (* = marked no-connect by the designer): RN9 3* 4* 5* 6*; RN11 1* 2* 7* 8*; RN19 3 4 5 6

### Buses and harness runs
bus DIG[0..7]
bus SEL[0..5]

### Notes on the sheet
- Title
- Size:
- Date:
- Orcad B
- Number:
- Time:
- Revision:
- Sheet
- of
- File:
- (in symbol battery) +; -

### Library data of the parts
C36 = C_Dup3
C37 = C_Dup4
J2 J3 = MHDR2X20: Header, 20-Pin, Dual row; LatestRevisionDate: 17-Jul-2002; LatestRevisionNote: Re-released for DXP Platform.; Publisher: Altium Limited
LED0-LED3 = LED_Dup1
Q1-Q6 = PNP
R23 R24 = R_Dup6
R25-R27 = R_Dup5
RN1-RN9 RN11-RN13 RN15 RN17 RN18 RN20-RN22 = RN_Dup1
RN10 RN14 RN16 RN19 RN34 = RN
U11 = DS1302_8SO: Part Number: TMP-13; ICA_PARTNUM: $$2098133$$DS1302S; ICA_MFR_NAME: MAXIM INTEGRATED PRODUCTS INC
U12 = 24LC04B_0
Y1 = ZTA

## Sheet 7_VGA.SchDoc: AX309  Http://www.heijin.org
size OrCAD B; DocumentNumber: 7; SheetNumber: 7; SheetTotal: 7; PageSetup: Record=PageOptions|CenterHorizontal=True|CenterVertical=True|PrintScale=0.75|XCorrection=1.00|YCorrection=1.00|PrintKind=0|BorderSize=5000000|LeftOffset=0|BottomOffset=0|Orientation=2|PaperLength=1000|PaperWidth=1000|Scale=100|PaperSource=7|PrintQuality=-4|MediaType=1|DitherType=10|PrintScaleMode=1|PaperKind=A4|PaperIndex=9
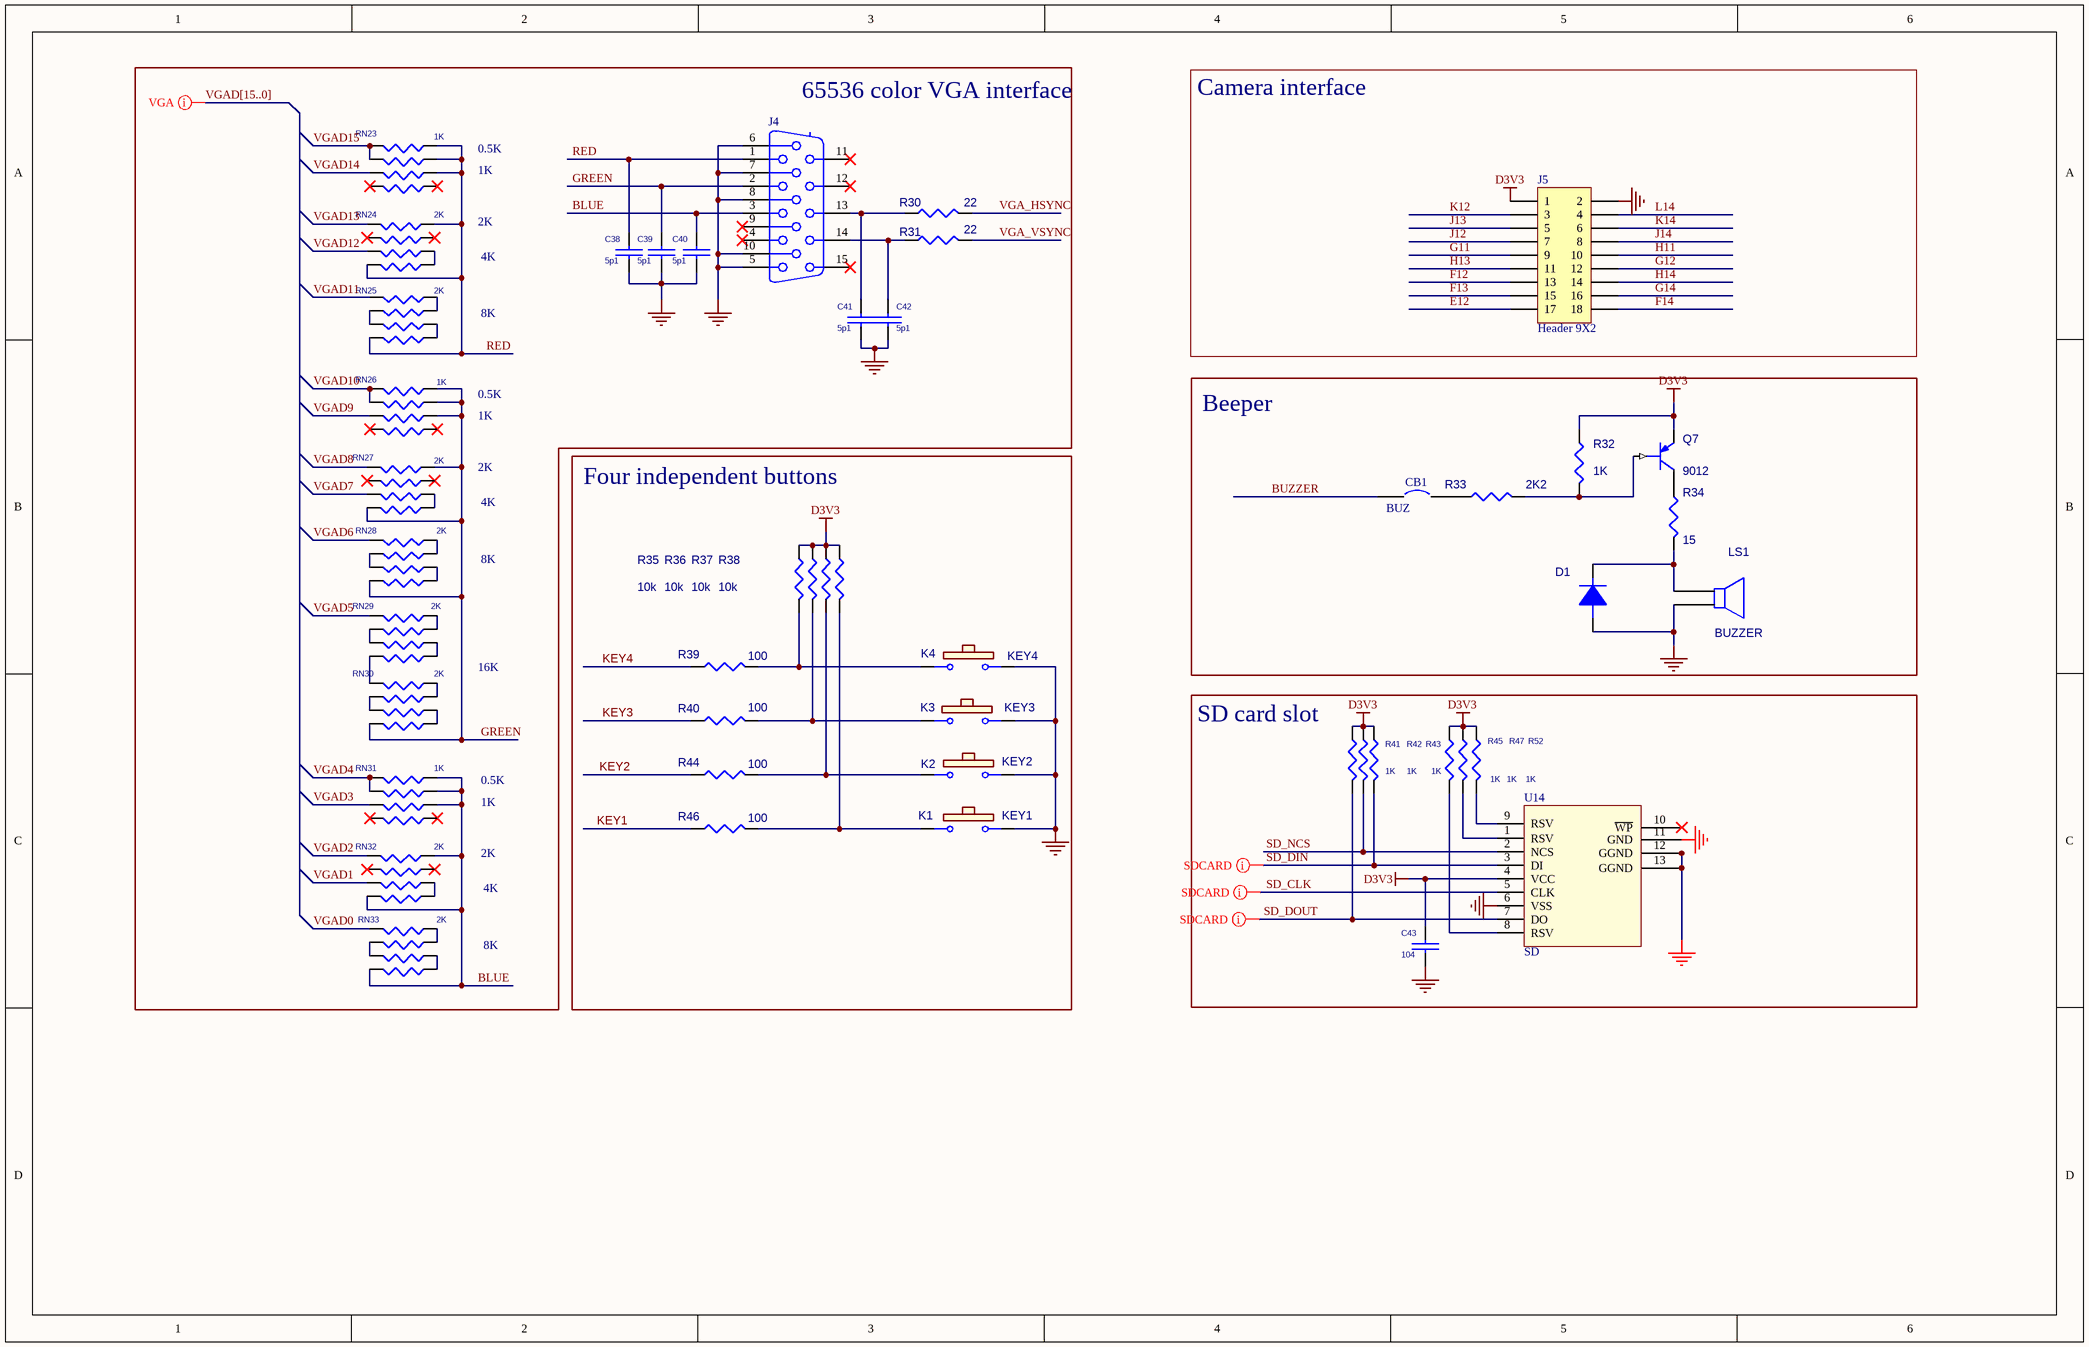
[diagram p6: 7_VGA.SchDoc]

### Parts
C38  5p1  [0603]
C39  5p1  [0603]
C40  5p1  [0603]
C41  5p1  [0603]
C42  5p1  [0603]
C43  104  [0402]
CB1  BUZ  [SIP2]
D1  (no value)  [1206]
J4  (no value)  [VGA]
J5  Header 9X2  [HDR2X9]
K1  KEY1  [KEY735SO]
K2  KEY2  [KEY735SO]
K3  KEY3  [KEY735SO]
K4  KEY4  [KEY735SO]
LS1  BUZZER  [BUZZER]
Q7  9012  [SOT23]
R30  22  [0603]
R31  22  [0603]
R32  1K  [0603]
R33  2K2  [0603]
R34  15  [0603]
R35  10k  [0603]
R36  10k  [0603]
R37  10k  [0603]
R38  10k  [0603]
R39  100  [0603]
R40  100  [0603]
R41  1K  [0603]
R42  1K  [0603]
R43  1K  [0603]
R44  100  [0603]
R45  1K  [0603]
R46  100  [0603]
R47  1K  [0603]
R52  1K  [0603]
RN23  1K  [RN-8P]
RN24  2K  [RN-8P]
RN25  2K  [RN-8P]
RN26  1K  [RN-8P]
RN27  2K  [RN-8P]
RN28  2K  [RN-8P]
RN29  2K  [RN-8P]
RN30  2K  [RN-8P]
RN31  1K  [RN-8P]
RN32  2K  [RN-8P]
RN33  2K  [RN-8P]
U14  SD  [TF]

### Blocks framed on the sheet
65536 color VGA interface: C38-C42 J4 R30 R31 RN23-RN33
Camera interface: J5
Beeper: CB1 D1 LS1 Q7 R32-R34
Four independent buttons: K1-K4 R35-R40 R44 R46
SD card slot: C43 R41-R43 R45 R47 R52 U14

### Nets
D3V3: C43.1 J5.1 Q7.2(EMITTER) R32.1 R35.1 R36.1 R37.1 R38.1 R41.1 R42.1 R43.1 R45.1 R47.1 R52.1 U14.4(VCC)
GND: C38.2 C39.2 C40.2 C41.2 C42.2 C43.2 D1.1(A) J4.5 J4.6 J4.7 J4.8 J4.10 J5.2 K1.2 K2.2 K3.1 K4.2 LS1.2 U14.6(VSS) U14.11(GND) U14.12(GGND) U14.13(GGND)
BLUE: C40.1 J4.3 RN31.2 RN31.3 RN31.4 RN32.4 RN32.8 RN33.8
BUZZER: CB1.1
E12: J5.17
F12: J5.13
F13: J5.15
F14: J5.18
G11: J5.9
G12: J5.12
G14: J5.16
GREEN: C39.1 J4.2 RN26.2 RN26.3 RN26.4 RN27.4 RN27.8 RN28.8 RN30.8
H11: J5.10
H13: J5.11
H14: J5.14
J12: J5.7
J13: J5.5
J14: J5.8
K12: J5.3
K14: J5.6
KEY1: R46.1
KEY2: R44.1
KEY3: R40.1
KEY4: R39.1
L14: J5.4
RED: C38.1 J4.1 RN23.2 RN23.3 RN23.4 RN24.4 RN24.8 RN25.8
SD_CLK: U14.5(CLK)
SD_DIN: R43.2 U14.3(DI)
SD_DOUT: R41.2 U14.7(DO)
SD_NCS: R42.2 U14.2(NCS)
VGA_HSYNC: R30.2
VGA_VSYNC: R31.2
VGAD0: RN33.5
VGAD1: RN32.7
VGAD2: RN32.5
VGAD3: RN31.7
VGAD4: RN31.5 RN31.6
VGAD5: RN29.5
VGAD6: RN28.5
VGAD7: RN27.7
VGAD8: RN27.5
VGAD9: RN26.7
VGAD10: RN26.5 RN26.6
VGAD11: RN25.5
VGAD12: RN24.7
VGAD13: RN24.5
VGAD14: RN23.7
VGAD15: RN23.5 RN23.6
NetC41_1: C41.1 J4.13 R30.1
NetC42_1: C42.1 J4.14 R31.1
NetCB1_2: CB1.2 R33.1
NetD1_2: D1.2(C) LS1.1 R34.2
NetK1_1: K1.1 R38.2 R46.2
NetK2_1: K2.1 R37.2 R44.2
NetK3_2: K3.2 R36.2 R40.2
NetK4_1: K4.1 R35.2 R39.2
NetQ7_1: Q7.1(BASE) R32.2 R33.2
NetQ7_3: Q7.3(COLLECTOR) R34.1
NetR45_2: R45.2 U14.8(RSV)
NetR47_2: R47.2 U14.1(RSV)
NetR52_2: R52.2 U14.9(RSV)
NetRN24_1: RN24.1 RN24.2
NetRN25_1: RN25.1 RN25.2
NetRN25_3: RN25.3 RN25.4
NetRN25_6: RN25.6 RN25.7
NetRN27_1: RN27.1 RN27.2
NetRN28_1: RN28.1 RN28.2
NetRN28_3: RN28.3 RN28.4
NetRN28_6: RN28.6 RN28.7
NetRN29_1: RN29.1 RN29.2
NetRN29_3: RN29.3 RN29.4
NetRN29_6: RN29.6 RN29.7
NetRN29_8: RN29.8 RN30.5
NetRN30_1: RN30.1 RN30.2
NetRN30_3: RN30.3 RN30.4
NetRN30_6: RN30.6 RN30.7
NetRN32_1: RN32.1 RN32.2
NetRN33_1: RN33.1 RN33.2
NetRN33_3: RN33.3 RN33.4
NetRN33_6: RN33.6 RN33.7

Not connected (* = marked no-connect by the designer): J4 4* 9* 11* 12* 15* 16(MH1) 17(MH2); RN23 1* 8*; RN24 3* 6*; RN26 1* 8*; RN27 3* 6*; RN31 1* 8*; RN32 3* 6*; U14 10(~{WP})*

### Buses and harness runs
bus VGAD[15..0]

### Layout directives
net class VGA; rule Matched Net Lengths [Tolerance = 100mil]: (no net found under the mark)
net class SDCARD; rule Matched Net Lengths [Tolerance = 100mil]: SD_CLK, SD_DIN, SD_DOUT

### Notes on the sheet
- 0.5K
- 1K
- 2K
- 4K
- 8K
- 16K
- Title
- Size:
- Date:
- Orcad B
- Number:
- Time:
- Revision:
- Sheet
- of
- File:

### Library data of the parts
C38-C43 = C_Dup1
CB1 = Circuit Breaker: Published: 24-Mar-1999; LatestRevisionDate: 17-Jul-2002; LatestRevisionNote: Re-released for DXP Platform.; PackageReference: SPST-2; Publisher: Altium Limited; PackageDescription: Switch; 2 Leads
D1 = 4148
J4 = Connector 15: Receptacle Assembly, 15-Pin, Sim Line Connector; PackageDocument: B; Positions: 15; Gender: Receptacle Header; Published: 15-Jun-2001; LatestRevisionDate: 17-Jul-2002; LatestRevisionNote: Re-released for DXP Platform.; DatasheetDocument: 24-Nov-1999; PackageReference: 788574; Publisher: Altium Limited; Orientation: Right Angle
J5 = Header 9X2: Header, 9-Pin, Dual row; LatestRevisionDate: 17-Jul-2002; LatestRevisionNote: Re-released for DXP Platform.; Publisher: Altium Limited
K1-K4 = KEYB
LS1 = SPEAKER
Q7 = PNP
R30 R31 R41-R43 R45 R47 R52 = R
R32-R34 = R_Dup3
R35-R40 R44 R46 = R_Dup2
RN23-RN33 = RN_Dup1

## Nets that join several sheets
D1V2: 1_POWER (5 pins), 4_FPGA (13 pins)
D3V3: 1_POWER (11 pins), 3_FPGA (R9.2 R50.2), 4_FPGA (52 pins), 5_SDRAM (15 pins), 6_DIG (19 pins), 7_VGA (15 pins)
GND: 1_POWER (19 pins), 2_FPGA (R49.2), 3_FPGA (R51.2), 4_FPGA (60 pins), 5_SDRAM (15 pins), 6_DIG (19 pins), 7_VGA (22 pins)
VCC: 1_POWER (8 pins), 6_DIG (J2.2 J3.2)
A4: 2_FPGA (U6.A4), 6_DIG (RN22.5)
A5: 2_FPGA (U6.A5), 6_DIG (RN22.7)
A6: 2_FPGA (U6.A6), 6_DIG (RN21.5)
A7: 2_FPGA (U6.A7), 6_DIG (RN21.6)
A8: 2_FPGA (U6.A8), 6_DIG (RN21.8)
A9: 2_FPGA (U6.A9), 6_DIG (RN20.6)
A10: 2_FPGA (U6.A10), 6_DIG (RN20.7)
A11: 2_FPGA (U6.A11), 6_DIG (RN18.5)
A12: 2_FPGA (U6.A12), 6_DIG (RN18.6)
A13: 2_FPGA (U6.A13), 6_DIG (RN18.8)
A14: 2_FPGA (U6.A14), 6_DIG (RN17.5)
B5: 2_FPGA (U6.B5), 6_DIG (RN22.6)
B6: 2_FPGA (U6.B6), 6_DIG (RN22.8)
B8: 2_FPGA (U6.B8), 6_DIG (RN21.7)
B10: 2_FPGA (U6.B10), 6_DIG (RN20.8)
B12: 2_FPGA (U6.B12), 6_DIG (RN18.7)
B14: 2_FPGA (U6.B14), 6_DIG (RN17.6)
B15: 2_FPGA (U6.B15), 6_DIG (RN17.7)
B16: 2_FPGA (U6.B16), 6_DIG (RN17.8)
BUZZER: 2_FPGA (U6.J11), 7_VGA (CB1.1)
C8: 2_FPGA (U6.C8), 6_DIG (RN20.5)
C9: 2_FPGA (U6.C9), 6_DIG (RN13.5)
C10: 2_FPGA (U6.C10), 6_DIG (RN13.7)
C15: 2_FPGA (U6.C15), 6_DIG (RN15.5)
C16: 2_FPGA (U6.C16), 6_DIG (RN15.6)
CLK: 3_FPGA (U6.T8), 4_FPGA (R3.1)
D11: 2_FPGA (U6.D11), 6_DIG (RN13.8)
D16: 2_FPGA (U6.D16), 6_DIG (RN15.7)
DIG0: 2_FPGA (U6.C7), 6_DIG (RN14.7)
DIG1: 2_FPGA (U6.E6), 6_DIG (RN10.5)
DIG2: 2_FPGA (U6.C5), 6_DIG (RN10.7)
DIG3: 2_FPGA (U6.F7), 6_DIG (RN14.6)
DIG4: 2_FPGA (U6.D6), 6_DIG (RN10.8)
DIG5: 2_FPGA (U6.E7), 6_DIG (RN14.8)
DIG6: 2_FPGA (U6.D5), 6_DIG (RN10.6)
DIG7: 2_FPGA (U6.C6), 6_DIG (RN14.5)
E11: 2_FPGA (U6.E11), 6_DIG (RN13.6)
E12: 2_FPGA (U6.E12), 7_VGA (J5.17)
E15: 2_FPGA (U6.E15), 6_DIG (RN15.8)
E16: 2_FPGA (U6.E16), 6_DIG (RN12.5)
F12: 2_FPGA (U6.F12), 7_VGA (J5.13)
F13: 2_FPGA (U6.F13), 7_VGA (J5.15)
F14: 2_FPGA (U6.F14), 7_VGA (J5.18)
F15: 2_FPGA (U6.F15), 6_DIG (RN12.6)
F16: 2_FPGA (U6.F16), 6_DIG (RN12.7)
G11: 2_FPGA (U6.G11), 7_VGA (J5.9)
G12: 2_FPGA (U6.G12), 7_VGA (J5.12)
G14: 2_FPGA (U6.G14), 7_VGA (J5.16)
G16: 2_FPGA (U6.G16), 6_DIG (RN12.8)
H11: 2_FPGA (U6.H11), 7_VGA (J5.10)
H13: 2_FPGA (U6.H13), 7_VGA (J5.11)
H14: 2_FPGA (U6.H14), 7_VGA (J5.14)
H15: 2_FPGA (U6.H15), 6_DIG (RN11.5)
H16: 2_FPGA (U6.H16), 6_DIG (RN11.6)
J12: 2_FPGA (U6.J12), 7_VGA (J5.7)
J13: 2_FPGA (U6.J13), 7_VGA (J5.5)
J14: 2_FPGA (U6.J14), 7_VGA (J5.8)
J16: 2_FPGA (U6.J16), 6_DIG (RN1.1)
K12: 2_FPGA (U6.K12), 7_VGA (J5.3)
K14: 2_FPGA (U6.K14), 7_VGA (J5.6)
K15: 2_FPGA (U6.K15), 6_DIG (RN1.3)
K16: 2_FPGA (U6.K16), 6_DIG (RN1.2)
KEY1: 3_FPGA (U6.C3), 7_VGA (R46.1)
KEY2: 3_FPGA (U6.D3), 7_VGA (R44.1)
KEY3: 3_FPGA (U6.E4), 7_VGA (R40.1)
KEY4: 3_FPGA (U6.E3), 7_VGA (R39.1)
L8: 3_FPGA (U6.L8), 6_DIG (RN5.4)
L14: 2_FPGA (U6.L14), 7_VGA (J5.4)
L16: 2_FPGA (U6.L16), 6_DIG (RN1.4)
LED0: 3_FPGA (U6.P4), 6_DIG (RN34.4)
LED1: 3_FPGA (U6.N5), 6_DIG (RN34.3)
LED2: 3_FPGA (U6.P5), 6_DIG (RN34.2)
LED3: 3_FPGA (U6.M6), 6_DIG (RN34.1)
M4: 3_FPGA (U6.M4), 6_DIG (RN8.1)
M5: 3_FPGA (U6.M5), 6_DIG (RN9.2)
M15: 2_FPGA (U6.M15), 6_DIG (RN2.2)
M16: 2_FPGA (U6.M16), 6_DIG (RN2.1)
N4: 3_FPGA (U6.N4), 6_DIG (RN9.1)
N6: 3_FPGA (U6.N6), 6_DIG (RN8.3)
N16: 2_FPGA (U6.N16), 6_DIG (RN2.3)
P2: 3_FPGA (U6.P2), 6_DIG (RN8.2)
P6: 3_FPGA (U6.P6), 6_DIG (RN8.4)
P15: 2_FPGA (U6.P15), 6_DIG (RN3.1)
P16: 2_FPGA (U6.P16), 6_DIG (RN2.4)
R1: 3_FPGA (U6.R1), 6_DIG (RN7.4)
R2: 3_FPGA (U6.R2), 6_DIG (RN7.3)
R5: 3_FPGA (U6.R5), 6_DIG (RN7.1)
R7: 3_FPGA (U6.R7), 6_DIG (RN6.2)
R9: 3_FPGA (U6.R9), 6_DIG (RN5.2)
R12: 2_FPGA (U6.R12), 6_DIG (RN4.4)
R14: 2_FPGA (U6.R14), 6_DIG (RN4.1)
R15: 2_FPGA (U6.R15), 6_DIG (RN3.3)
R16: 2_FPGA (U6.R16), 6_DIG (RN3.2)
RESET: 3_FPGA (U6.L3), 4_FPGA (R21.1)
RTC_DATA: 2_FPGA (U6.D14), 6_DIG (R25.2 U11.6)
RTC_NRST: 2_FPGA (U6.C13), 6_DIG (R26.2 U11.5)
RTC_SCLK: 2_FPGA (U6.E13), 6_DIG (R27.2 U11.7)
RXD: 1_POWER (R7.1 U4.26), 2_FPGA (U6.C11)
S_A0: 3_FPGA (U6.J3), 5_SDRAM (U9.23)
S_A1: 3_FPGA (U6.J4), 5_SDRAM (U9.24)
S_A2: 3_FPGA (U6.K3), 5_SDRAM (U9.25)
S_A3: 3_FPGA (U6.K5), 5_SDRAM (U9.26)
S_A4: 3_FPGA (U6.P1), 5_SDRAM (U9.29)
S_A5: 3_FPGA (U6.N1), 5_SDRAM (U9.30)
S_A6: 3_FPGA (U6.M2), 5_SDRAM (U9.31)
S_A7: 3_FPGA (U6.M1), 5_SDRAM (U9.32)
S_A8: 3_FPGA (U6.L1), 5_SDRAM (U9.33)
S_A9: 3_FPGA (U6.K2), 5_SDRAM (U9.34)
S_A10: 3_FPGA (U6.K6), 5_SDRAM (U9.22)
S_A11: 3_FPGA (U6.K1), 5_SDRAM (U9.35)
S_A12: 3_FPGA (U6.J1), 5_SDRAM (U9.36)
S_BA0: 3_FPGA (U6.G6), 5_SDRAM (U9.20)
S_BA1: 3_FPGA (U6.J6), 5_SDRAM (U9.21)
S_CKE: 3_FPGA (U6.H2), 5_SDRAM (U9.37)
S_CLK: 3_FPGA (U6.H4), 5_SDRAM (U9.38)
S_DB0: 3_FPGA (U6.A3), 5_SDRAM (U9.2)
S_DB1: 3_FPGA (U6.B3), 5_SDRAM (U9.4)
S_DB2: 3_FPGA (U6.A2), 5_SDRAM (U9.5)
S_DB3: 3_FPGA (U6.B2), 5_SDRAM (U9.7)
S_DB4: 3_FPGA (U6.B1), 5_SDRAM (U9.8)
S_DB5: 3_FPGA (U6.C2), 5_SDRAM (U9.10)
S_DB6: 3_FPGA (U6.C1), 5_SDRAM (U9.11)
S_DB7: 3_FPGA (U6.D1), 5_SDRAM (U9.13)
S_DB8: 3_FPGA (U6.H5), 5_SDRAM (U9.42)
S_DB9: 3_FPGA (U6.G5), 5_SDRAM (U9.44)
S_DB10: 3_FPGA (U6.H3), 5_SDRAM (U9.45)
S_DB11: 3_FPGA (U6.F6), 5_SDRAM (U9.47)
S_DB12: 3_FPGA (U6.G3), 5_SDRAM (U9.48)
S_DB13: 3_FPGA (U6.F5), 5_SDRAM (U9.50)
S_DB14: 3_FPGA (U6.F3), 5_SDRAM (U9.51)
S_DB15: 3_FPGA (U6.F4), 5_SDRAM (U9.53)
S_DQM0: 3_FPGA (U6.E2), 5_SDRAM (U9.15)
S_DQM1: 3_FPGA (U6.H1), 5_SDRAM (U9.39)
S_NCAS: 3_FPGA (U6.F2), 5_SDRAM (U9.17)
S_NCS: 3_FPGA (U6.G1), 5_SDRAM (U9.19)
S_NRAS: 3_FPGA (U6.F1), 5_SDRAM (U9.18)
S_NWE: 3_FPGA (U6.E1), 5_SDRAM (U9.16)
SCL: 3_FPGA (U6.N12), 6_DIG (R23.2 U12.6)
SD_CLK: 3_FPGA (U6.M3), 7_VGA (U14.5)
SD_DIN: 3_FPGA (U6.L5), 7_VGA (R43.2 U14.3)
SD_DOUT: 3_FPGA (U6.L4), 7_VGA (R41.2 U14.7)
SD_NCS: 3_FPGA (U6.N3), 7_VGA (R42.2 U14.2)
SDA: 3_FPGA (U6.P12), 6_DIG (R24.2 U12.5)
SEL0: 2_FPGA (U6.D8), 6_DIG (RN19.7)
SEL1: 2_FPGA (U6.E8), 6_DIG (RN19.8)
SEL2: 2_FPGA (U6.F9), 6_DIG (RN16.5)
SEL3: 2_FPGA (U6.F10), 6_DIG (RN16.6)
SEL4: 2_FPGA (U6.E10), 6_DIG (RN16.7)
SEL5: 2_FPGA (U6.D9), 6_DIG (RN16.8)
SPI_CLK: 3_FPGA (R5.2), 4_FPGA (U8.6)
SPI_CS_N: 3_FPGA (R11.2), 4_FPGA (R15.1 U8.1)
SPI_DIN: 3_FPGA (R6.2), 4_FPGA (U8.5)
SPI_DOUT: 3_FPGA (U6.P10), 4_FPGA (R16.1)
T4: 3_FPGA (U6.T4), 6_DIG (RN7.2)
T5: 3_FPGA (U6.T5), 6_DIG (RN6.4)
T6: 3_FPGA (U6.T6), 6_DIG (RN6.3)
T7: 3_FPGA (U6.T7), 6_DIG (RN6.1)
T9: 3_FPGA (U6.T9), 6_DIG (RN5.3)
T12: 2_FPGA (U6.T12), 6_DIG (RN5.1)
T13: 2_FPGA (U6.T13), 6_DIG (RN4.3)
T14: 2_FPGA (U6.T14), 6_DIG (RN4.2)
T15: 2_FPGA (U6.T15), 6_DIG (RN3.4)
TXD: 1_POWER (R4.1 U4.25), 2_FPGA (U6.D12)
VGA_HSYNC: 2_FPGA (U6.M14), 7_VGA (R30.2)
VGA_VSYNC: 2_FPGA (U6.L13), 7_VGA (R31.2)
VGAD0: 3_FPGA (U6.P7), 7_VGA (RN33.5)
VGAD1: 3_FPGA (U6.M7), 7_VGA (RN32.7)
VGAD2: 3_FPGA (U6.P8), 7_VGA (RN32.5)
VGAD3: 3_FPGA (U6.N8), 7_VGA (RN31.7)
VGAD4: 3_FPGA (U6.L7), 7_VGA (RN31.5 RN31.6)
VGAD5: 3_FPGA (U6.M9), 7_VGA (RN29.5)
VGAD6: 3_FPGA (U6.N9), 7_VGA (RN28.5)
VGAD7: 3_FPGA (U6.P9), 7_VGA (RN27.7)
VGAD8: 3_FPGA (U6.L10), 7_VGA (RN27.5)
VGAD9: 3_FPGA (U6.M10), 7_VGA (RN26.7)
VGAD10: 3_FPGA (U6.P11), 7_VGA (RN26.5 RN26.6)
VGAD11: 3_FPGA (U6.M11), 7_VGA (RN25.5)
VGAD12: 3_FPGA (U6.M12), 7_VGA (RN24.7)
VGAD13: 2_FPGA (U6.L12), 7_VGA (RN24.5)
VGAD14: 2_FPGA (U6.N14), 7_VGA (RN23.7)
VGAD15: 2_FPGA (U6.M13), 7_VGA (RN23.5 RN23.6)